# EAGLE design Tractive System Board Rev8 (EAGLE 9.6.2)

## Sheet 1 of 3
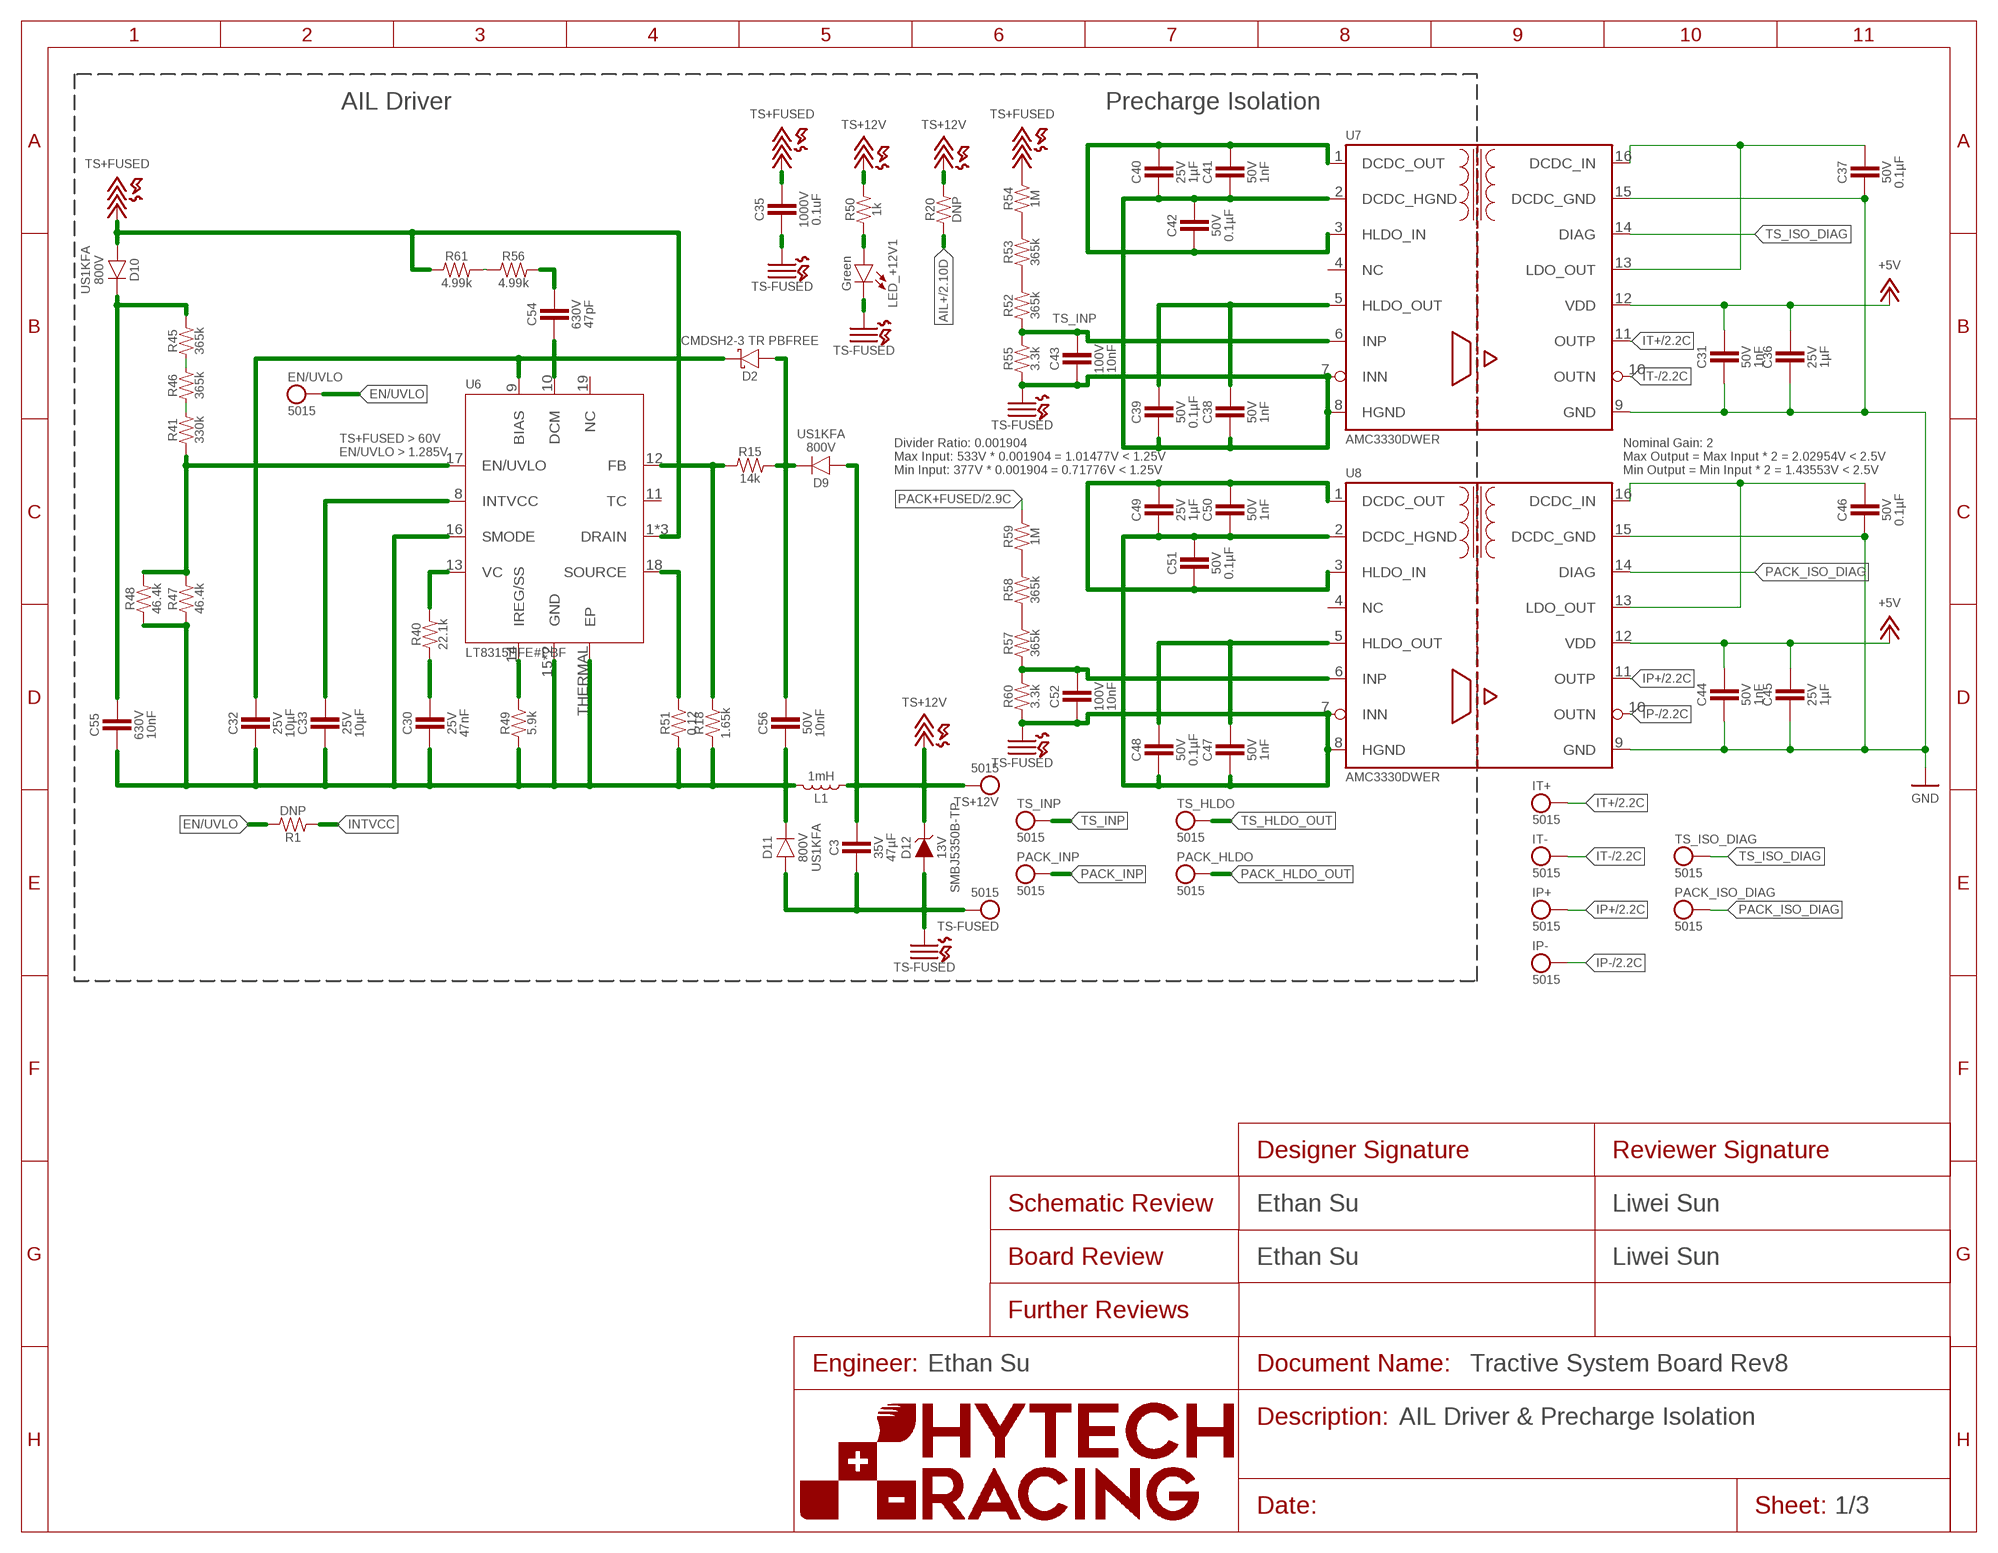
[diagram p0: schematic, sheet 1]
FRAME1 (FRAME): DESCRIPTION_1: AIL Driver & Precharge Isolation; DESIGNER_BOARD: Ethan Su; DESIGNER_SCHEMATIC: Ethan Su; ENGINEER: Ethan Su; REVIEWER_BOARD: Liwei Sun; REVIEWER_SCHEMATIC: Liwei Sun

### Parts
C3  CAPACITOR_2220_35V_47UF  [2220-CAP]
C30  CAPACITOR_0603_25V_47NF  [0603-CAP]
C31  CAPACITOR_1206_50V_1NF  [1206-CAP]
C32  CAPACITOR_0603_25V_10UF  [0603-CAP]
C33  CAPACITOR_0603_25V_10UF  [0603-CAP]
C35  CAPACITOR_1812_1000V_0.1UF  [1812-CAP]
C36  CAPACITOR_1206_25V_1UF  [1206-CAP]
C37  CAPACITOR_0603_50V_0.1UF  [0603-CAP]
C38  CAPACITOR_1206_50V_1NF  [1206-CAP]
C39  CAPACITOR_1206_50V_0.1UF  [1206-CAP]
C40  CAPACITOR_0603_25V_1UF  [0603-CAP]
C41  CAPACITOR_0603_50V_1NF  [0603-CAP]
C42  CAPACITOR_0603_50V_0.1UF  [0603-CAP]
C43  CAPACITOR_0603_100V_10NF  [0603-CAP]
C44  CAPACITOR_1206_50V_1NF  [1206-CAP]
C45  CAPACITOR_1206_25V_1UF  [1206-CAP]
C46  CAPACITOR_0603_50V_0.1UF  [0603-CAP]
C47  CAPACITOR_1206_50V_1NF  [1206-CAP]
C48  CAPACITOR_1206_50V_0.1UF  [1206-CAP]
C49  CAPACITOR_0603_25V_1UF  [0603-CAP]
C50  CAPACITOR_0603_50V_1NF  [0603-CAP]
C51  CAPACITOR_0603_50V_0.1UF  [0603-CAP]
C52  CAPACITOR_0603_100V_10NF  [0603-CAP]
C54  CAPACITOR_1206_630V_47PF  [1206-CAP]
C55  CAPACITOR_1206_630V_10NF  [1206-CAP]
C56  CAPACITOR_0603_50V_10NF  [0603-CAP]
D2  SCHOTTKY_SOD323_30VV  [SOD-323]
D9  RECTIFIER_800V_SOD-123FA  [SOD-123FA]
D10  RECTIFIER_800V_SOD-123FA  [SOD-123FA]
D11  RECTIFIER_800V_SOD-123FA  [SOD-123FA]
D12  ZENER_SMB(DO-214AA)_13V  [SMB(DO-214AA)]
EN/UVLO  TEST_POINT  [5015]
IP+  TEST_POINT  [5015]
IP-  TEST_POINT  [5015]
IT+  TEST_POINT  [5015]
IT-  TEST_POINT  [5015]
L1  INDUCTOR_SRR0745A_1MH  [SRR0745A-102M]
LED_+12V1  LED_0603_GREEN  [0603-LED]
PACK_HLDO  TEST_POINT  [5015]
PACK_INP  TEST_POINT  [5015]
PACK_ISO_DIAG  TEST_POINT  [5015]
R1  RESISTOR_0603_DNP  [0603-RES]
R15  RESISTOR_0603_14K  [0603-RES]
R18  RESISTOR_0603_1.65K  [0603-RES]
R20  RESISTOR_0603_DNP  [0603-RES]
R40  RESISTOR_0603_22.1K  [0603-RES]
R41  RESISTOR_0805_HV330K  [0805-RES]
R45  RESISTOR_0805_HV365K  [0805-RES]
R46  RESISTOR_0805_HV365K  [0805-RES]
R47  RESISTOR_1206_HV46.4K  [1206-RES]
R48  RESISTOR_1206_HV46.4K  [1206-RES]
R49  RESISTOR_0603_5.9K  [0603-RES]
R50  RESISTOR_0603_1K  [0603-RES]
R51  RESISTOR_0603_0.12  [0603-RES]
R52  RESISTOR_0805_HV365K  [0805-RES]
R53  RESISTOR_0805_HV365K  [0805-RES]
R54  RESISTOR_0805_HV1M  [0805-RES]
R55  RESISTOR_0603_HV3.3K  [0603-RES]
R56  RESISTOR_1206_HV4.99K  [1206-RES]
R57  RESISTOR_0805_HV365K  [0805-RES]
R58  RESISTOR_0805_HV365K  [0805-RES]
R59  RESISTOR_0805_HV1M  [0805-RES]
R60  RESISTOR_0603_HV3.3K  [0603-RES]
R61  RESISTOR_1206_HV4.99K  [1206-RES]
TS+12V  TEST_POINT  [5015]
TS-FUSED  TEST_POINT  [5015]
TS_HLDO  TEST_POINT  [5015]
TS_INP  TEST_POINT  [5015]
TS_ISO_DIAG  TEST_POINT  [5015]
U6  LT8315  [TSSOP-20(16)]
U7  AMC3330_AIRGAP  [SOIC-16W-AIRGAP]
U8  AMC3330_AIRGAP  [SOIC-16W-AIRGAP]

### Nets
+5V: C31.1 C36.1 C44.1 C45.1 U7.12(VDD) U8.12(VDD) ; also sheet 2
AIL+: R20.1 ; also sheet 2
EN/UVLO: EN/UVLO.1 R1.2 R41.1 R47.2 R48.2 U6.17(EN/UVLO)
FB: R15.1 R18.2 U6.12(FB)
GND: C31.2 C36.2 C37.2 C44.2 C45.2 C46.2 U7.9(GND) U7.15(DCDC_GND) U8.9(GND) U8.15(DCDC_GND) ; also sheet 2
INTVCC: C33.1 R1.1 U6.8(INTVCC)
IP+: IP+.1 U8.11(OUTP) ; also sheet 2
IP-: IP-.1 U8.10(OUTN) ; also sheet 2
IREG/SS: R49.2 U6.14(IREG/SS)
IT+: IT+.1 U7.11(OUTP) ; also sheet 2
IT-: IT-.1 U7.10(OUTN) ; also sheet 2
N$1: R41.2 R46.1
N$4: R45.1 R46.2
N$33: C37.1 U7.13(LDO_OUT) U7.16(DCDC_IN)
N$34: R56.1 R61.2
N$35: C54.1 R56.2
N$38: C54.2 U6.10(DCM)
N$43: C30.1 R40.1
N$44: LED_+12V1.2(A) R50.1
N$46: C55.1 D10.C R45.2
N$49: C32.1 D2.C U6.9(BIAS)
N$51: C40.1 C41.1 C42.2 U7.1(DCDC_OUT) U7.3(HLDO_IN)
N$52: C46.1 U8.13(LDO_OUT) U8.16(DCDC_IN)
N$55: C56.1 D2.A D9.C R15.2
N$59: R52.2 R53.1
N$60: R53.2 R54.1
N$64: C49.1 C50.1 C51.2 U8.1(DCDC_OUT) U8.3(HLDO_IN)
N$65: R57.2 R58.1
N$66: R58.2 R59.1
PACK+FUSED: R59.2 ; also sheet 2
PACK_HLDO_OUT: C47.1 C48.1 PACK_HLDO.1 U8.5(HLDO_OUT)
PACK_INP: C52.1 PACK_INP.1 R57.1 R60.2 U8.6(INP)
PACK_ISO_DIAG: PACK_ISO_DIAG.1 U8.14(DIAG)
PGND: C30.2 C32.2 C33.2 C55.2 C56.2 D11.C L1.2 R18.1 R47.1 R48.1 R49.1 R51.1 U6.15(GND) U6.16(SMODE) U6.20(GND) U6.THERMAL(EP)
SOURCE: R51.2 U6.18(SOURCE)
TS+12V: C3.1 D9.A D12.C L1.1 R20.2 R50.2 TS+12V.1
TS+FUSED: C35.1 D10.A R54.2 R61.1 U6.1(DRAIN) U6.2(DRAIN) U6.3(DRAIN) ; also sheet 2
TS-FUSED: C3.2 C35.2 C38.2 C39.2 C40.2 C41.2 C42.1 C43.2 C47.2 C48.2 C49.2 C50.2 C51.1 C52.2 D11.A D12.A LED_+12V1.1(C) R55.1 R60.1 TS-FUSED.1 U7.2(DCDC_HGND) U7.7(INN) U7.8(HGND) U8.2(DCDC_HGND) U8.7(INN) U8.8(HGND) ; also sheet 2
TS_HLDO_OUT: C38.1 C39.1 TS_HLDO.1 U7.5(HLDO_OUT)
TS_INP: C43.1 R52.1 R55.2 TS_INP.1 U7.6(INP)
TS_ISO_DIAG: TS_ISO_DIAG.1 U7.14(DIAG)
VC: R40.2 U6.13(VC)
Unconnected: U6.11(TC) U6.19(NC) U7.4(NC) U8.4(NC)

### Notes on the sheet
- AIL Driver | Precharge Isolation
- TS+FUSED > 60V
  EN/UVLO > 1.285V
- Divider Ratio: 0.001904
  Max Input: 533V * 0.001904 = 1.01477V < 1.25V
  Min Input: 377V * 0.001904 = 0.71776V < 1.25V
- Nominal Gain: 2
  Max Output = Max Input * 2 = 2.02954V < 2.5V
  Min Output = Min Input * 2 = 1.43553V < 2.5V

## Sheet 2 of 3
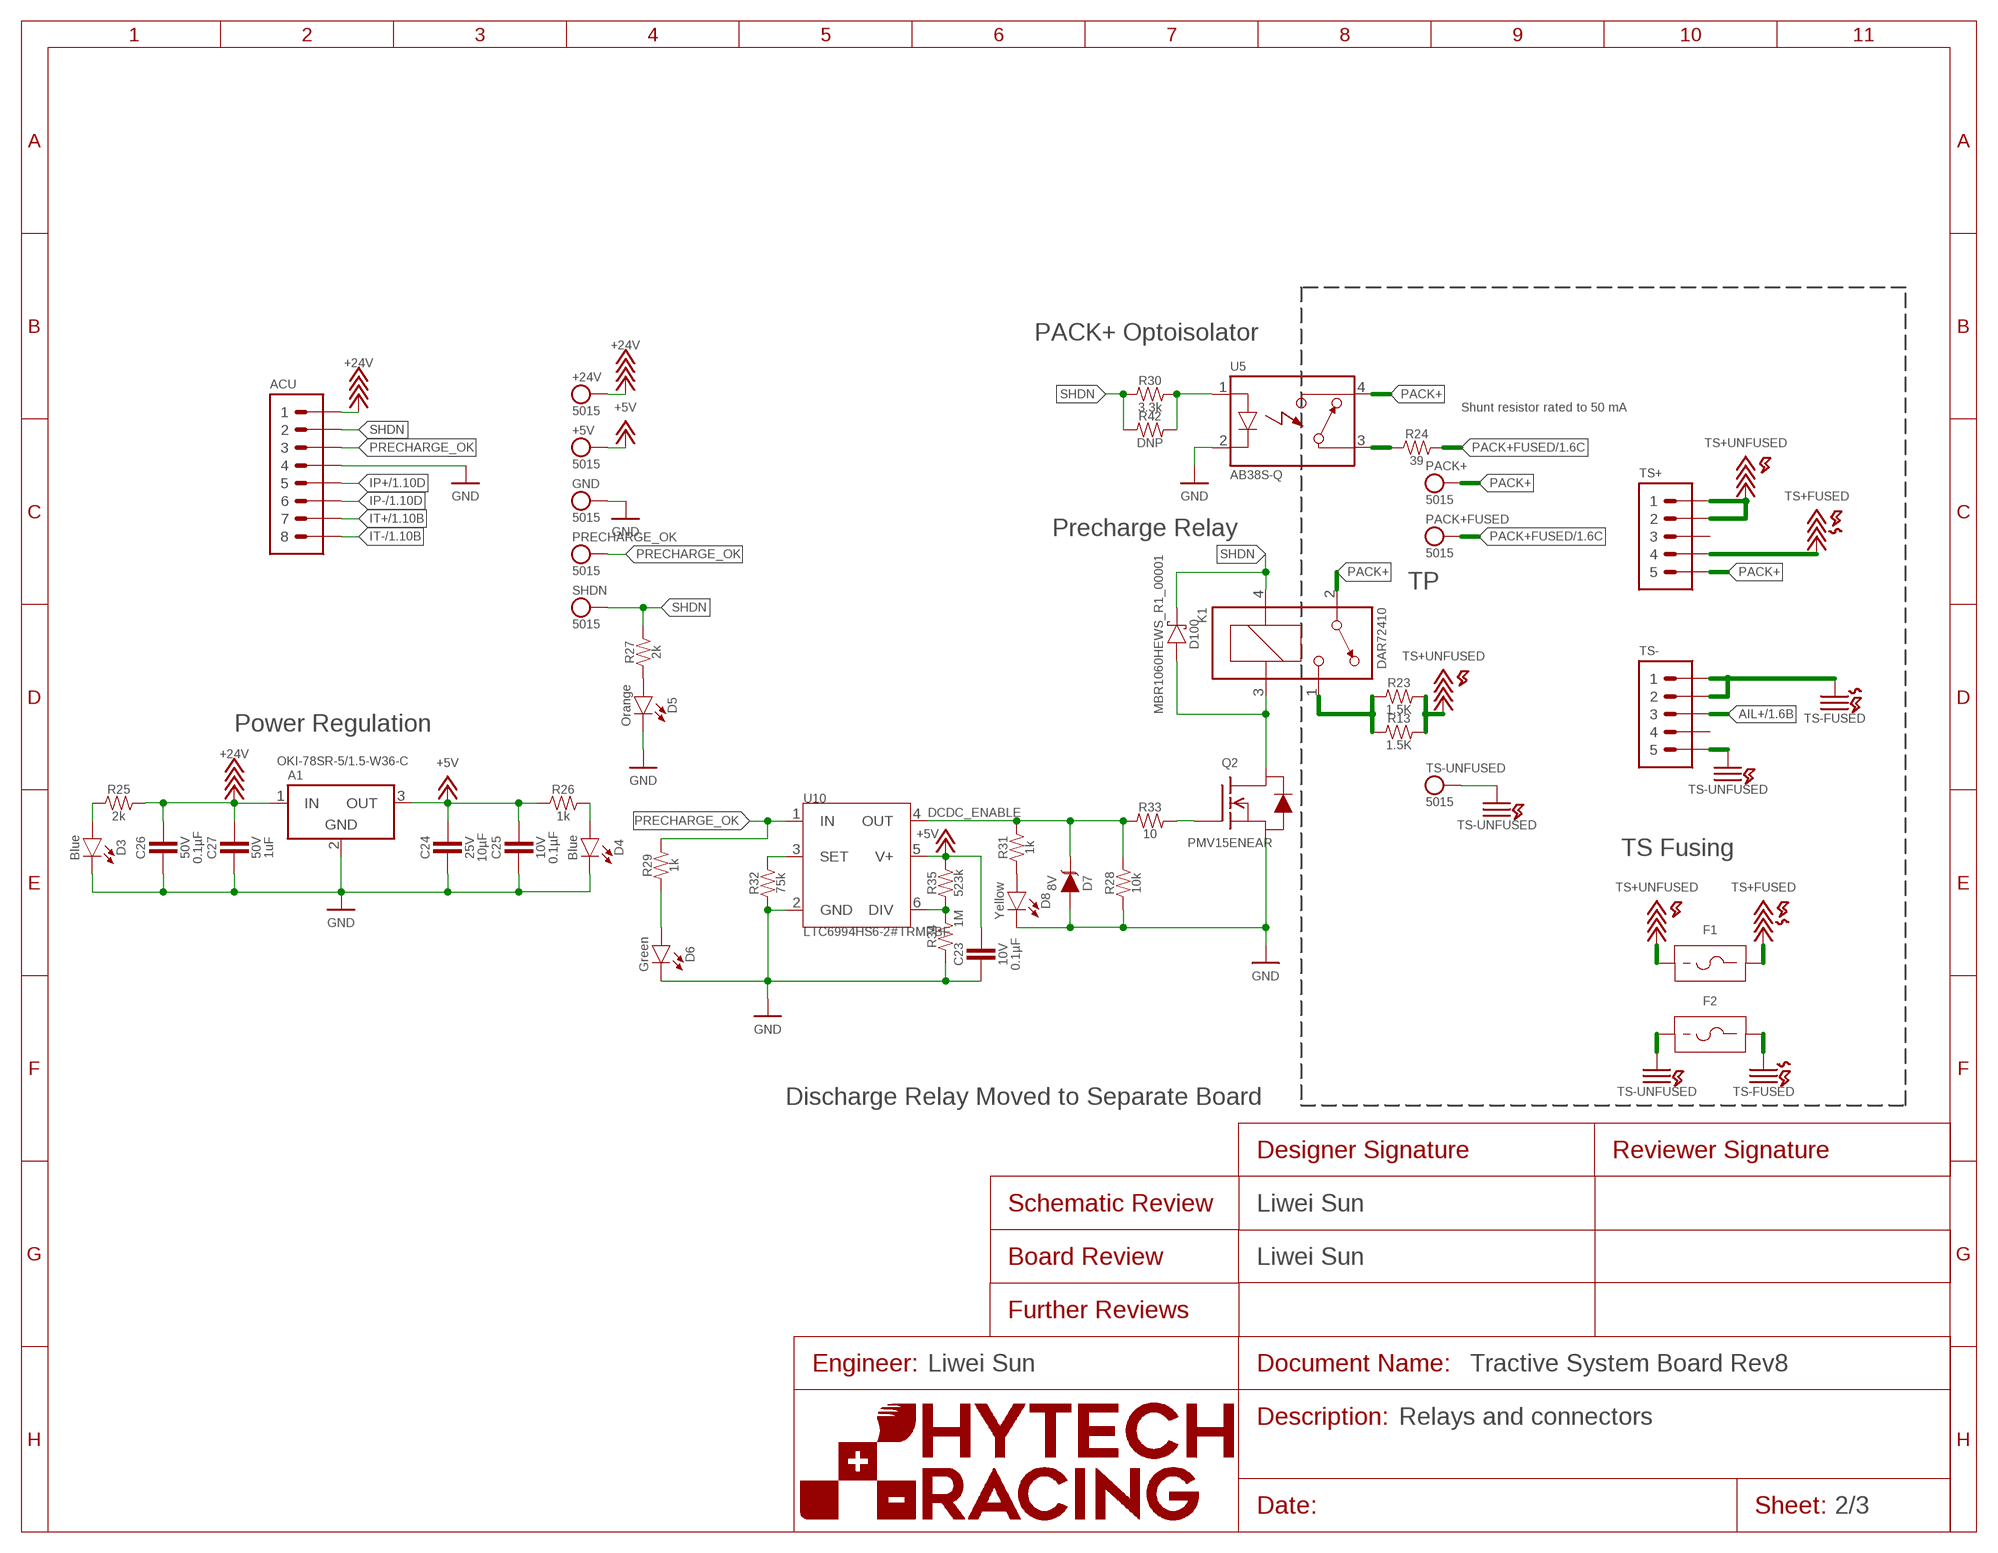
[diagram p1: schematic, sheet 2]
FRAME4 (FRAME): DESCRIPTION_1: Relays and connectors; DESIGNER_BOARD: Liwei Sun; DESIGNER_SCHEMATIC: Liwei Sun; ENGINEER: Liwei Sun

### Parts
+5V  TEST_POINT  [5015]
+24V  TEST_POINT  [5015]
A1  VOLTAGE_REGULATOR_MODULE_OKI-78SR_5V  [OKI-78SR]
ACU  CONNECTOR-8_μF_T_V_BLACK  [MOLEX_MICROFIT_PTH_VERTICAL_08_DUAL]
C23  CAPACITOR_0603_10V_0.1UF  [0603-CAP]
C24  CAPACITOR_0603_25V_10UF  [0603-CAP]
C25  CAPACITOR_0603_10V_0.1UF  [0603-CAP]
C26  CAPACITOR_0603_50V_0.1UF  [0603-CAP]
C27  CAPACITOR_0603_50V_1UF  [0603-CAP]
D3  LED_0603_BLUE  [0603-LED]
D4  LED_0603_BLUE  [0603-LED]
D5  LED_0603_ORANGE  [0603-LED]
D6  LED_0603_GREEN  [0603-LED]
D7  TVS__8V  [SOT-23]
D8  LED_0603_YELLOW  [0603-LED]
D100  SCHOTTKY_SOD323_60V  [SOD-323]
F1  FUSE_HOLDER_122  [122]
F2  FUSE_HOLDER_122  [122]
GND  TEST_POINT  [5015]
K1  RELAY_SPST_NO_D_24  [D]
PACK+  TEST_POINT  [5015]
PACK+FUSED  TEST_POINT  [5015]
PRECHARGE_OK  TEST_POINT  [5015]
Q2  TRANSISTOR_N_MOS__PMV15ENEA  [SOT-23]
R13  RESISTOR_B20-SHORTENED_1.5K  [B20-SHORTENED]
R23  RESISTOR_B20-SHORTENED_1.5K  [B20-SHORTENED]
R24  RESISTOR_0603_39  [0603-RES]
R25  RESISTOR_0603_2K  [0603-RES]
R26  RESISTOR_0603_1K  [0603-RES]
R27  RESISTOR_0603_2K  [0603-RES]
R28  RESISTOR_0603_10K  [0603-RES]
R29  RESISTOR_0603_1K  [0603-RES]
R30  RESISTOR_0603_3.3K  [0603-RES]
R31  RESISTOR_0603_1K  [0603-RES]
R32  RESISTOR_0603_75K  [0603-RES]
R33  RESISTOR_0603_10  [0603-RES]
R34  RESISTOR_0805_1M  [0805-RES]
R35  RESISTOR_0805_523K  [0805-RES]
R42  RESISTOR_0603_DNP  [0603-RES]
SHDN  TEST_POINT  [5015]
TS+  CONNECTOR-5_MICRO_V7S_  [MOLEX_MICROFIT_PTH_VERTICAL_07_SINGLE_SPACED]
TS-  CONNECTOR-5_MICRO_V6S_  [MOLEX_MICROFIT_PTH_VERTICAL_06_SINGLE_SPACED]
TS-UNFUSED  TEST_POINT  [5015]
U5  RELAY_SOLIDSTATE_NO_AB38S-Q-AIRGAP  [SOP-04-AIRGAP]
U10  LTC6994-2  [SOT-23-6]

### Nets
+5V: +5V.1 A1.3(OUT) C23.1 C24.1 C25.1 R26.1 R35.2 U10.5(V+) ; also sheet 1
+24V: +24V.1 A1.1(IN) ACU.1 C26.1 C27.1 R25.2
AIL+: TS-.3 ; also sheet 1
DCDC_ENABLE: D7.3(C) R28.2 R31.2 R33.1 U10.4(OUT)
GND: A1.2(GND) ACU.4 C23.2 C24.2 C25.2 C26.2 C27.2 D3.1(C) D4.1(C) D5.1(C) D6.1(C) D7.1(A) D8.1(C) GND.1 Q2.2(S) R28.1 R32.1 R34.1 U5.2(CONTROL-) U10.2(GND) ; also sheet 1
IP+: ACU.5 ; also sheet 1
IP-: ACU.6 ; also sheet 1
IT+: ACU.7 ; also sheet 1
IT-: ACU.8 ; also sheet 1
N$2: D5.2(A) R27.1
N$3: Q2.1(G) R33.2
N$10: R32.2 U10.3(SET)
N$11: R34.2 R35.1 U10.6(DIV)
N$22: D6.2(A) R29.1
N$24: D8.2(A) R31.1
N$25: D3.2(A) R25.1
N$30: D4.2(A) R26.2
N$40: D100.A K1.3(COIL-) Q2.3(D)
N$50: K1.1(CONTACT2) R13.1 R23.1
N$53: R30.2 R42.2 U5.1(CONTROL+)
N$57: R24.1 U5.3(CONTACT1)
PACK+: K1.2(CONTACT1) PACK+.1 TS+.5 U5.4(CONTACT2)
PACK+FUSED: PACK+FUSED.1 R24.2 ; also sheet 1
PRECHARGE_OK: ACU.3 PRECHARGE_OK.1 R29.2 U10.1(IN)
SHDN: ACU.2 D100.C K1.4(COIL+) R27.2 R30.1 R42.1 SHDN.1
TS+FUSED: F1.3 F1.4 TS+.4 ; also sheet 1
TS+UNFUSED: F1.1 F1.2 R13.2 R23.2 TS+.1 TS+.2
TS-FUSED: F2.3 F2.4 TS-.1 TS-.2 ; also sheet 1
TS-UNFUSED: F2.1 F2.2 TS-.5 TS-UNFUSED.1
Unconnected: TS+.3 TS-.4

### Notes on the sheet
- PACK+ Optoisolator
- Shunt resistor rated to 50 mA
- Precharge Relay
- TP
- Power Regulation
- TS Fusing
- Discharge Relay Moved to Separate Board

## Sheet 3 of 3
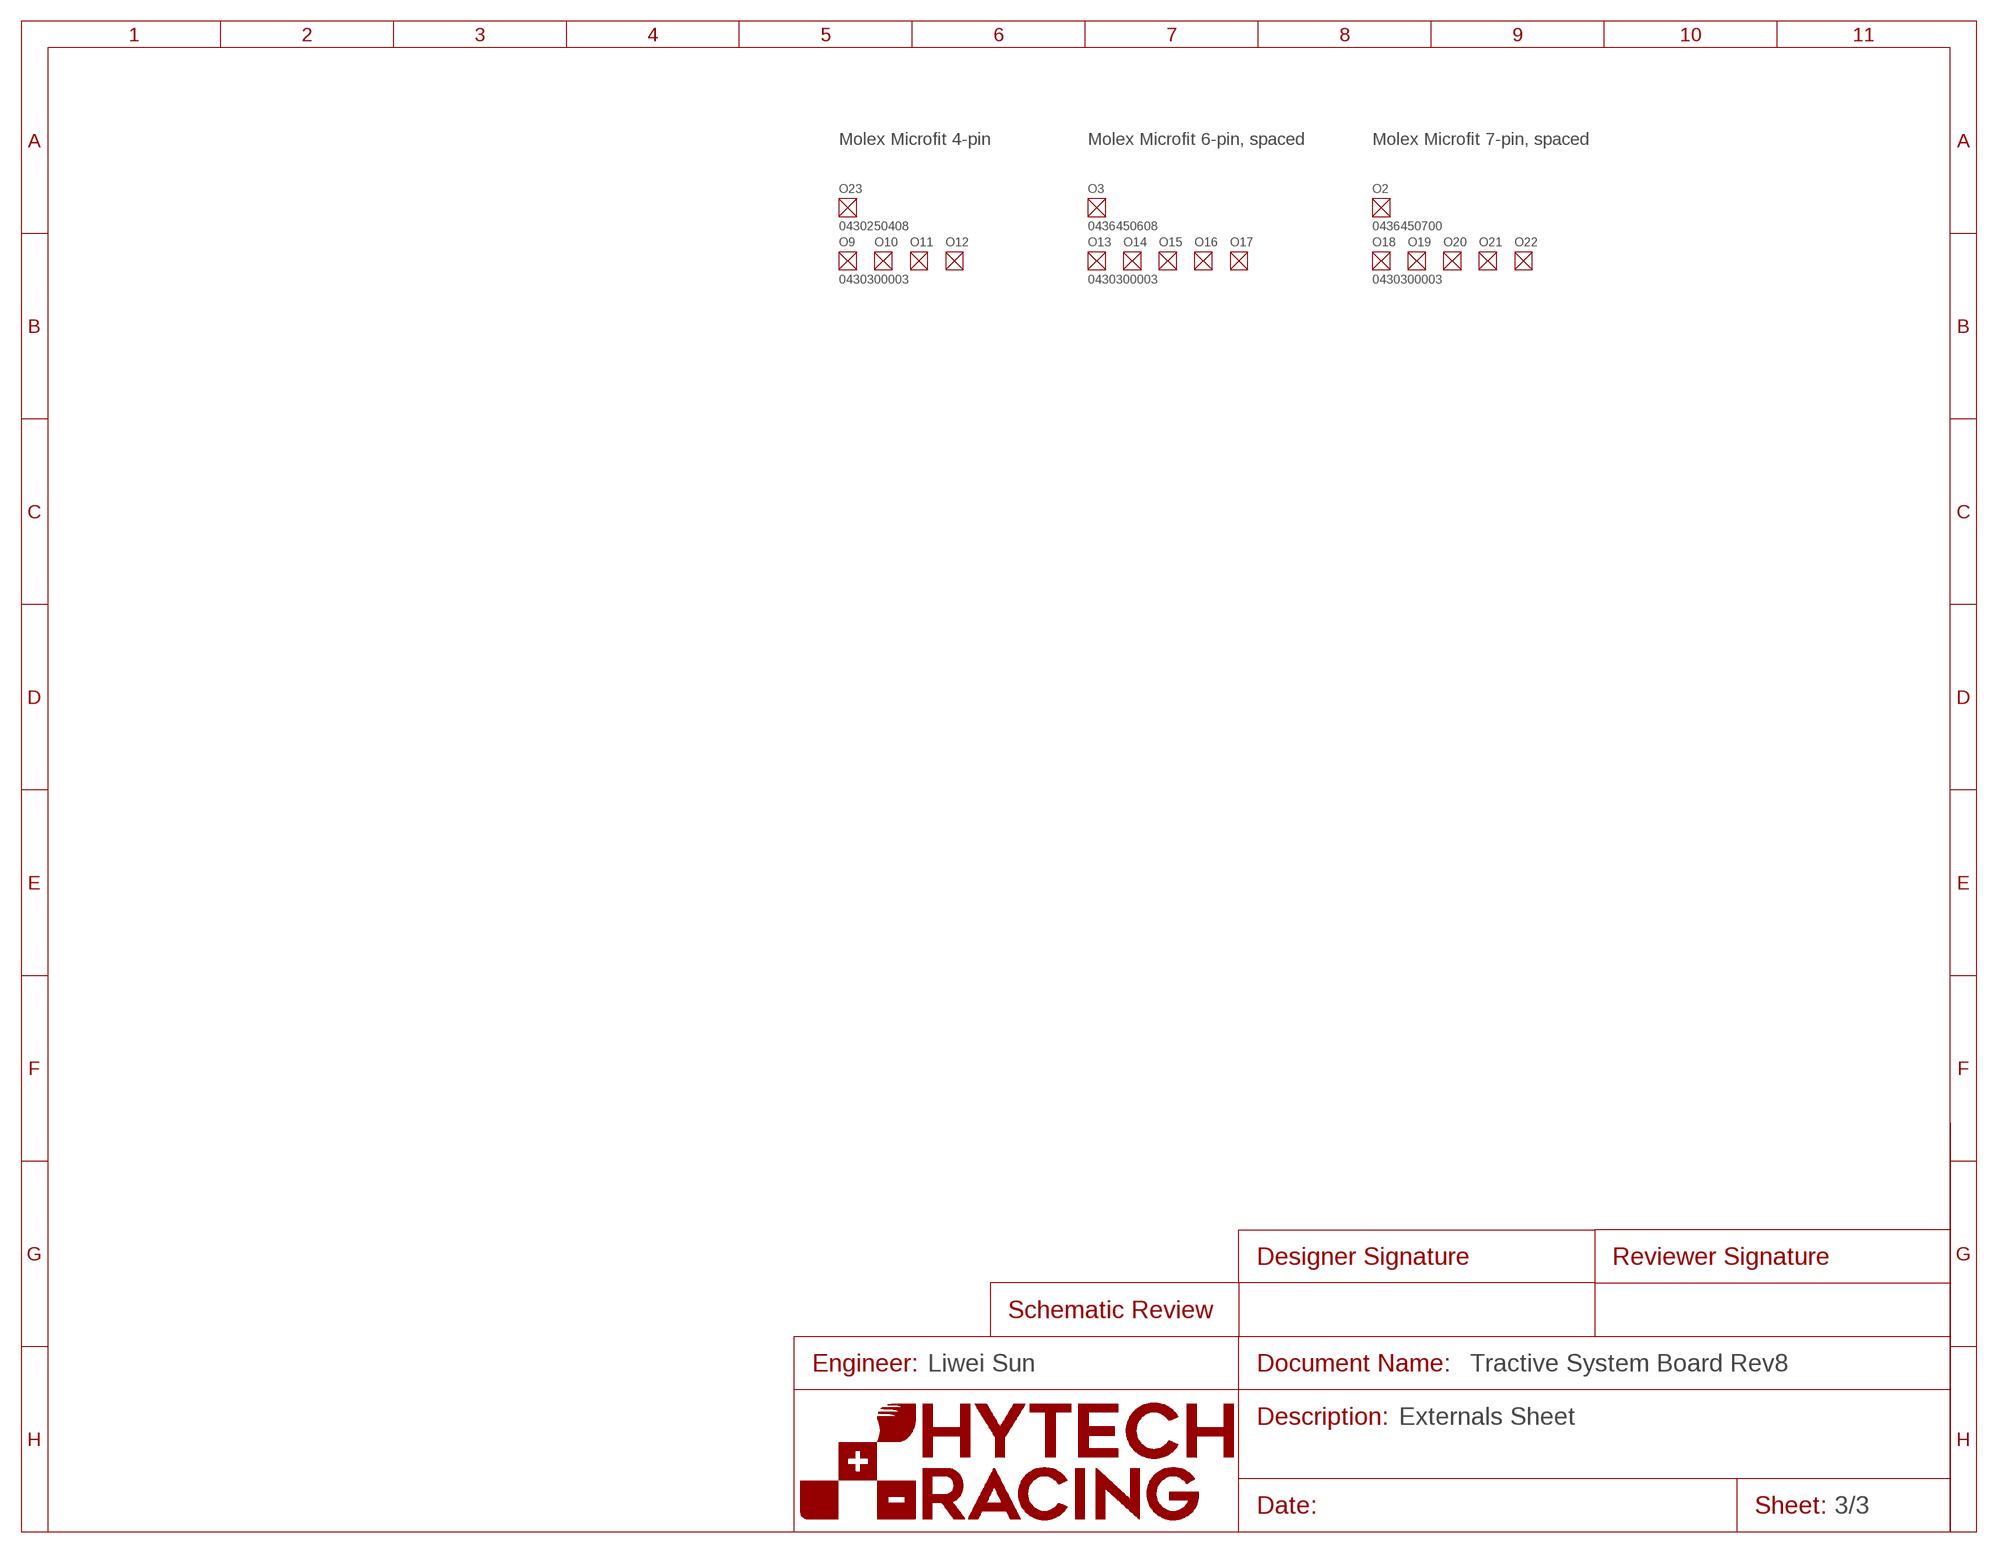
[diagram p2: schematic, sheet 3]
O2 (RECEPTACLE-7_MICROFIT): DKPN: WM2405-ND; MANUFACTURER: Molex; MOPN: 538-43645-0700; MPN: 0436450700
O3 (RECEPTACLE-6_SINGLE_MICROFIT): DKPN: WM13217-ND; MANUFACTURER: Molex; MOPN: 538-43645-0608; MPN: 0436450608
O9 (CRIMP_MICROFIT_20-24): DKPN: WM2776CT-ND; GAUGE: 20-24; MANUFACTURER: Molex; MOPN: 538-43030-0003; MPN: 0430300003
O10 (CRIMP_MICROFIT_20-24): DKPN: WM2776CT-ND; GAUGE: 20-24; MANUFACTURER: Molex; MOPN: 538-43030-0003; MPN: 0430300003
O11 (CRIMP_MICROFIT_20-24): DKPN: WM2776CT-ND; GAUGE: 20-24; MANUFACTURER: Molex; MOPN: 538-43030-0003; MPN: 0430300003
O12 (CRIMP_MICROFIT_20-24): DKPN: WM2776CT-ND; GAUGE: 20-24; MANUFACTURER: Molex; MOPN: 538-43030-0003; MPN: 0430300003
O13 (CRIMP_MICROFIT_20-24): DKPN: WM2776CT-ND; GAUGE: 20-24; MANUFACTURER: Molex; MOPN: 538-43030-0003; MPN: 0430300003
O14 (CRIMP_MICROFIT_20-24): DKPN: WM2776CT-ND; GAUGE: 20-24; MANUFACTURER: Molex; MOPN: 538-43030-0003; MPN: 0430300003
O15 (CRIMP_MICROFIT_20-24): DKPN: WM2776CT-ND; GAUGE: 20-24; MANUFACTURER: Molex; MOPN: 538-43030-0003; MPN: 0430300003
O16 (CRIMP_MICROFIT_20-24): DKPN: WM2776CT-ND; GAUGE: 20-24; MANUFACTURER: Molex; MOPN: 538-43030-0003; MPN: 0430300003
O17 (CRIMP_MICROFIT_20-24): DKPN: WM2776CT-ND; GAUGE: 20-24; MANUFACTURER: Molex; MOPN: 538-43030-0003; MPN: 0430300003
O18 (CRIMP_MICROFIT_20-24): DKPN: WM2776CT-ND; GAUGE: 20-24; MANUFACTURER: Molex; MOPN: 538-43030-0003; MPN: 0430300003
O19 (CRIMP_MICROFIT_20-24): DKPN: WM2776CT-ND; GAUGE: 20-24; MANUFACTURER: Molex; MOPN: 538-43030-0003; MPN: 0430300003
O20 (CRIMP_MICROFIT_20-24): DKPN: WM2776CT-ND; GAUGE: 20-24; MANUFACTURER: Molex; MOPN: 538-43030-0003; MPN: 0430300003
O21 (CRIMP_MICROFIT_20-24): DKPN: WM2776CT-ND; GAUGE: 20-24; MANUFACTURER: Molex; MOPN: 538-43030-0003; MPN: 0430300003
O22 (CRIMP_MICROFIT_20-24): DKPN: WM2776CT-ND; GAUGE: 20-24; MANUFACTURER: Molex; MOPN: 538-43030-0003; MPN: 0430300003
O23 (RECEPTACLE-4_MICROFIT): DKPN: WM11225-ND; MANUFACTURER: Molex; MOPN: 538-43025-0408; MPN: 0430250408
U$49 (FRAME_SCHEMATIC_ONLY): DESCRIPTION_1: Externals Sheet; ENGINEER: Liwei Sun

### Notes on the sheet
- Molex Microfit 4-pin | Molex Microfit 6-pin, spaced | Molex Microfit 7-pin, spaced

## Library data of the parts
+5V +24V EN/UVLO GND IP+ IP- IT+ IT- PACK+ PACK+FUSED PACK_HLDO PACK_INP PACK_ISO_DIAG PRECHARGE_OK SHDN TS+12V TS-FUSED TS-UNFUSED TS_HLDO TS_INP TS_ISO_DIAG = HyTechDevices:TEST_POINT: Test Point for Probing; DKPN: 36-5015CT-ND; MANUFACTURER: Keystone Electronics; MOPN: 534-5015; MPN: 5015
A1 = HyTechDevices:VOLTAGE_REGULATOR_MODULE_?_*: Voltage Regulator Modules OKI-78SR Datasheet <https://www.mouser.com/datasheet/2/281/oki-78sr-56393.pdf>; DKPN: 811-2196-5-ND; MANUFACTURER: Murata Power Solutions Inc.; MOPN: 580-OKI78SR5/1.5W36C; MPN: OKI-78SR-5/1.5-W36-C
ACU = HyTechDevices:CONNECTOR-8_?_*: 8 Pin Connector; DKPN: WM1798-ND; MANUFACTURER: Molex; MOPN: 538-43045-0814; MPN: 430450814
C3 = HyTechDevices:CAPACITOR_?_*: Capacitor, Non-Polarized VJ...1BC Series Datasheet <https://www.mouser.com/datasheet/2/427/vjw1bcbascomseries-1762447.pdf> Samsung Datasheet <https://www.mouser.com/datasheet/2/585/MLCC-1837944.pdf> Samsung Automotive MLCC Datasheet <https://www.mouser.com/datasheet/2/585/MLCC_Automotive-1837966.pdf> Walsin Datasheet <https://www.mouser.com/datasheet/2/210/WTC_MLCC_General_Purpose-1534899.pdf> GRM188R61A226ME15D <https://www.mouser.com/datasheet/2/281/1/GRM188R61A226ME15_02A-1985787.pdf> GRM188R61E106MA73D <https://www.mouser.com/datasheet/2/281/1/GRM188R61E106MA73_01A-1985806.pdf> 885012006013 <https://www.mouser.com/datasheet/2/445/885012006013-1726946.pdf> 2220Y6300105KXTWS2 <https://www.mouser.com/datasheet/2/218/SMD_High_and_Std_StackiCap_P62-1825512.pdf> Yageo Class 2, X5R <https://www.mouser.com/datasheet/2/447/UPY_GPHC_X5R_4V_to_50V_26-1827097.pdf> TDK C Series <https://www.mouser.com/ProductDetail/TDK/C3216X5R1V226M160AC?qs=%2Fha2pyFadujbcx9jh7lYl%2F4NeMoXFhdc8AqVWNq4wW6M2y7zl6GzBuhgtI0ngznN> AVX Automotive MLCC <https://www.mouser.com/datasheet/2/40/AutoMLCC-777028.pdf> KEMET X7R Series <https://www.mouser.com/datasheet/2/212/KEM_C1002_X7R_SMD-1102033.pdf> Kyocera AVX <https://www.mouser.com/datasheet/2/40/C0GNP0_Dielectric-951274.pdf> GRM21BR61H <https://www.mouser.com/datasheet/2/281/1/GRM21BR61H106KE43_01A-1986884.pdf> C1812W104KDRACTU <https://www.mouser.com/datasheet/2/212/KEM_C1034_X7R_HV_ARC_SMD-1101730.pdf> CGA series - MLCC Automotive grade <https://product.tdk.com/system/files/dam/doc/product/capacitor/ceramic/mlcc/catalog/mlcc_automotive_general_en.pdf>; CAPACITANCE: 47µF; DKPN: 445-CGA9N1X7R1V476M230KCCT-ND; MANUFACTURER: TDK Corporation; MOPN: 810-CGA9N1X7R1V476M2; MPN: CGA9N1X7R1V476M230KC; TOLERANCE: 20%; VOLTAGE: 35V
C23 C25 = HyTechDevices:CAPACITOR_?_*: Capacitor, Non-Polarized VJ...1BC Series Datasheet <https://www.mouser.com/datasheet/2/427/vjw1bcbascomseries-1762447.pdf> Samsung Datasheet <https://www.mouser.com/datasheet/2/585/MLCC-1837944.pdf> Samsung Automotive MLCC Datasheet <https://www.mouser.com/datasheet/2/585/MLCC_Automotive-1837966.pdf> Walsin Datasheet <https://www.mouser.com/datasheet/2/210/WTC_MLCC_General_Purpose-1534899.pdf> GRM188R61A226ME15D <https://www.mouser.com/datasheet/2/281/1/GRM188R61A226ME15_02A-1985787.pdf> GRM188R61E106MA73D <https://www.mouser.com/datasheet/2/281/1/GRM188R61E106MA73_01A-1985806.pdf> 885012006013 <https://www.mouser.com/datasheet/2/445/885012006013-1726946.pdf> 2220Y6300105KXTWS2 <https://www.mouser.com/datasheet/2/218/SMD_High_and_Std_StackiCap_P62-1825512.pdf> Yageo Class 2, X5R <https://www.mouser.com/datasheet/2/447/UPY_GPHC_X5R_4V_to_50V_26-1827097.pdf> TDK C Series <https://www.mouser.com/ProductDetail/TDK/C3216X5R1V226M160AC?qs=%2Fha2pyFadujbcx9jh7lYl%2F4NeMoXFhdc8AqVWNq4wW6M2y7zl6GzBuhgtI0ngznN> AVX Automotive MLCC <https://www.mouser.com/datasheet/2/40/AutoMLCC-777028.pdf> KEMET X7R Series <https://www.mouser.com/datasheet/2/212/KEM_C1002_X7R_SMD-1102033.pdf> Kyocera AVX <https://www.mouser.com/datasheet/2/40/C0GNP0_Dielectric-951274.pdf> GRM21BR61H <https://www.mouser.com/datasheet/2/281/1/GRM21BR61H106KE43_01A-1986884.pdf> C1812W104KDRACTU <https://www.mouser.com/datasheet/2/212/KEM_C1034_X7R_HV_ARC_SMD-1101730.pdf> CGA series - MLCC Automotive grade <https://product.tdk.com/system/files/dam/doc/product/capacitor/ceramic/mlcc/catalog/mlcc_automotive_general_en.pdf>; CAPACITANCE: 0.1µF; DKPN: 720-1688-1-ND; MANUFACTURER: Vishay Vitramon; MOPN: 77-VJ0603Y104JXQPBC; MPN: VJ0603Y104JXQPW1BC; TOLERANCE: 5%; VOLTAGE: 10V
C24 C32 C33 = HyTechDevices:CAPACITOR_?_*: Capacitor, Non-Polarized VJ...1BC Series Datasheet <https://www.mouser.com/datasheet/2/427/vjw1bcbascomseries-1762447.pdf> Samsung Datasheet <https://www.mouser.com/datasheet/2/585/MLCC-1837944.pdf> Samsung Automotive MLCC Datasheet <https://www.mouser.com/datasheet/2/585/MLCC_Automotive-1837966.pdf> Walsin Datasheet <https://www.mouser.com/datasheet/2/210/WTC_MLCC_General_Purpose-1534899.pdf> GRM188R61A226ME15D <https://www.mouser.com/datasheet/2/281/1/GRM188R61A226ME15_02A-1985787.pdf> GRM188R61E106MA73D <https://www.mouser.com/datasheet/2/281/1/GRM188R61E106MA73_01A-1985806.pdf> 885012006013 <https://www.mouser.com/datasheet/2/445/885012006013-1726946.pdf> 2220Y6300105KXTWS2 <https://www.mouser.com/datasheet/2/218/SMD_High_and_Std_StackiCap_P62-1825512.pdf> Yageo Class 2, X5R <https://www.mouser.com/datasheet/2/447/UPY_GPHC_X5R_4V_to_50V_26-1827097.pdf> TDK C Series <https://www.mouser.com/ProductDetail/TDK/C3216X5R1V226M160AC?qs=%2Fha2pyFadujbcx9jh7lYl%2F4NeMoXFhdc8AqVWNq4wW6M2y7zl6GzBuhgtI0ngznN> AVX Automotive MLCC <https://www.mouser.com/datasheet/2/40/AutoMLCC-777028.pdf> KEMET X7R Series <https://www.mouser.com/datasheet/2/212/KEM_C1002_X7R_SMD-1102033.pdf> Kyocera AVX <https://www.mouser.com/datasheet/2/40/C0GNP0_Dielectric-951274.pdf> GRM21BR61H <https://www.mouser.com/datasheet/2/281/1/GRM21BR61H106KE43_01A-1986884.pdf> C1812W104KDRACTU <https://www.mouser.com/datasheet/2/212/KEM_C1034_X7R_HV_ARC_SMD-1101730.pdf> CGA series - MLCC Automotive grade <https://product.tdk.com/system/files/dam/doc/product/capacitor/ceramic/mlcc/catalog/mlcc_automotive_general_en.pdf>; CAPACITANCE: 10µF; DKPN: 490-7202-1-ND; MANUFACTURER: Murata Electronics; MOPN: 81-GRM188R61E106MA3D; MPN: GRM188R61E106MA73D; TOLERANCE: 20%; VOLTAGE: 25V
C26 C37 C42 C46 C51 = HyTechDevices:CAPACITOR_?_*: Capacitor, Non-Polarized VJ...1BC Series Datasheet <https://www.mouser.com/datasheet/2/427/vjw1bcbascomseries-1762447.pdf> Samsung Datasheet <https://www.mouser.com/datasheet/2/585/MLCC-1837944.pdf> Samsung Automotive MLCC Datasheet <https://www.mouser.com/datasheet/2/585/MLCC_Automotive-1837966.pdf> Walsin Datasheet <https://www.mouser.com/datasheet/2/210/WTC_MLCC_General_Purpose-1534899.pdf> GRM188R61A226ME15D <https://www.mouser.com/datasheet/2/281/1/GRM188R61A226ME15_02A-1985787.pdf> GRM188R61E106MA73D <https://www.mouser.com/datasheet/2/281/1/GRM188R61E106MA73_01A-1985806.pdf> 885012006013 <https://www.mouser.com/datasheet/2/445/885012006013-1726946.pdf> 2220Y6300105KXTWS2 <https://www.mouser.com/datasheet/2/218/SMD_High_and_Std_StackiCap_P62-1825512.pdf> Yageo Class 2, X5R <https://www.mouser.com/datasheet/2/447/UPY_GPHC_X5R_4V_to_50V_26-1827097.pdf> TDK C Series <https://www.mouser.com/ProductDetail/TDK/C3216X5R1V226M160AC?qs=%2Fha2pyFadujbcx9jh7lYl%2F4NeMoXFhdc8AqVWNq4wW6M2y7zl6GzBuhgtI0ngznN> AVX Automotive MLCC <https://www.mouser.com/datasheet/2/40/AutoMLCC-777028.pdf> KEMET X7R Series <https://www.mouser.com/datasheet/2/212/KEM_C1002_X7R_SMD-1102033.pdf> Kyocera AVX <https://www.mouser.com/datasheet/2/40/C0GNP0_Dielectric-951274.pdf> GRM21BR61H <https://www.mouser.com/datasheet/2/281/1/GRM21BR61H106KE43_01A-1986884.pdf> C1812W104KDRACTU <https://www.mouser.com/datasheet/2/212/KEM_C1034_X7R_HV_ARC_SMD-1101730.pdf> CGA series - MLCC Automotive grade <https://product.tdk.com/system/files/dam/doc/product/capacitor/ceramic/mlcc/catalog/mlcc_automotive_general_en.pdf>; CAPACITANCE: 0.1µF; DKPN: 311-1344-1-ND; MANUFACTURER: Yageo; MOPN: 603-CC603KRX7R9BB104; MPN: CC0603KRX7R9BB104; TOLERANCE: 10%; VOLTAGE: 50V
C27 = HyTechDevices:CAPACITOR_?_*: Capacitor, Non-Polarized VJ...1BC Series Datasheet <https://www.mouser.com/datasheet/2/427/vjw1bcbascomseries-1762447.pdf> Samsung Datasheet <https://www.mouser.com/datasheet/2/585/MLCC-1837944.pdf> Samsung Automotive MLCC Datasheet <https://www.mouser.com/datasheet/2/585/MLCC_Automotive-1837966.pdf> Walsin Datasheet <https://www.mouser.com/datasheet/2/210/WTC_MLCC_General_Purpose-1534899.pdf> GRM188R61A226ME15D <https://www.mouser.com/datasheet/2/281/1/GRM188R61A226ME15_02A-1985787.pdf> GRM188R61E106MA73D <https://www.mouser.com/datasheet/2/281/1/GRM188R61E106MA73_01A-1985806.pdf> 885012006013 <https://www.mouser.com/datasheet/2/445/885012006013-1726946.pdf> 2220Y6300105KXTWS2 <https://www.mouser.com/datasheet/2/218/SMD_High_and_Std_StackiCap_P62-1825512.pdf> Yageo Class 2, X5R <https://www.mouser.com/datasheet/2/447/UPY_GPHC_X5R_4V_to_50V_26-1827097.pdf> TDK C Series <https://www.mouser.com/ProductDetail/TDK/C3216X5R1V226M160AC?qs=%2Fha2pyFadujbcx9jh7lYl%2F4NeMoXFhdc8AqVWNq4wW6M2y7zl6GzBuhgtI0ngznN> AVX Automotive MLCC <https://www.mouser.com/datasheet/2/40/AutoMLCC-777028.pdf> KEMET X7R Series <https://www.mouser.com/datasheet/2/212/KEM_C1002_X7R_SMD-1102033.pdf> Kyocera AVX <https://www.mouser.com/datasheet/2/40/C0GNP0_Dielectric-951274.pdf> GRM21BR61H <https://www.mouser.com/datasheet/2/281/1/GRM21BR61H106KE43_01A-1986884.pdf> C1812W104KDRACTU <https://www.mouser.com/datasheet/2/212/KEM_C1034_X7R_HV_ARC_SMD-1101730.pdf> CGA series - MLCC Automotive grade <https://product.tdk.com/system/files/dam/doc/product/capacitor/ceramic/mlcc/catalog/mlcc_automotive_general_en.pdf>; CAPACITANCE: 1uF; DKPN: 587-2400-2-ND; MANUFACTURER: Taiyo Yuden; MOPN: 963-UMK107BJ105KA-T; MPN: UMK107BJ105KA-T; TOLERANCE: 10%; VOLTAGE: 50V
C30 = HyTechDevices:CAPACITOR_?_*: Capacitor, Non-Polarized VJ...1BC Series Datasheet <https://www.mouser.com/datasheet/2/427/vjw1bcbascomseries-1762447.pdf> Samsung Datasheet <https://www.mouser.com/datasheet/2/585/MLCC-1837944.pdf> Samsung Automotive MLCC Datasheet <https://www.mouser.com/datasheet/2/585/MLCC_Automotive-1837966.pdf> Walsin Datasheet <https://www.mouser.com/datasheet/2/210/WTC_MLCC_General_Purpose-1534899.pdf> GRM188R61A226ME15D <https://www.mouser.com/datasheet/2/281/1/GRM188R61A226ME15_02A-1985787.pdf> GRM188R61E106MA73D <https://www.mouser.com/datasheet/2/281/1/GRM188R61E106MA73_01A-1985806.pdf> 885012006013 <https://www.mouser.com/datasheet/2/445/885012006013-1726946.pdf> 2220Y6300105KXTWS2 <https://www.mouser.com/datasheet/2/218/SMD_High_and_Std_StackiCap_P62-1825512.pdf> Yageo Class 2, X5R <https://www.mouser.com/datasheet/2/447/UPY_GPHC_X5R_4V_to_50V_26-1827097.pdf> TDK C Series <https://www.mouser.com/ProductDetail/TDK/C3216X5R1V226M160AC?qs=%2Fha2pyFadujbcx9jh7lYl%2F4NeMoXFhdc8AqVWNq4wW6M2y7zl6GzBuhgtI0ngznN> AVX Automotive MLCC <https://www.mouser.com/datasheet/2/40/AutoMLCC-777028.pdf> KEMET X7R Series <https://www.mouser.com/datasheet/2/212/KEM_C1002_X7R_SMD-1102033.pdf> Kyocera AVX <https://www.mouser.com/datasheet/2/40/C0GNP0_Dielectric-951274.pdf> GRM21BR61H <https://www.mouser.com/datasheet/2/281/1/GRM21BR61H106KE43_01A-1986884.pdf> C1812W104KDRACTU <https://www.mouser.com/datasheet/2/212/KEM_C1034_X7R_HV_ARC_SMD-1101730.pdf> CGA series - MLCC Automotive grade <https://product.tdk.com/system/files/dam/doc/product/capacitor/ceramic/mlcc/catalog/mlcc_automotive_general_en.pdf>; CAPACITANCE: 47nF; DKPN: 478-6340-1-ND; MANUFACTURER: Kyocera AVX; MOPN: 581-06033C473K42ZA; MPN: 06033C473K4Z2A; TOLERANCE: 10%; VOLTAGE: 25V
C31 C38 C44 C47 = HyTechDevices:CAPACITOR_?_*: Capacitor, Non-Polarized VJ...1BC Series Datasheet <https://www.mouser.com/datasheet/2/427/vjw1bcbascomseries-1762447.pdf> Samsung Datasheet <https://www.mouser.com/datasheet/2/585/MLCC-1837944.pdf> Samsung Automotive MLCC Datasheet <https://www.mouser.com/datasheet/2/585/MLCC_Automotive-1837966.pdf> Walsin Datasheet <https://www.mouser.com/datasheet/2/210/WTC_MLCC_General_Purpose-1534899.pdf> GRM188R61A226ME15D <https://www.mouser.com/datasheet/2/281/1/GRM188R61A226ME15_02A-1985787.pdf> GRM188R61E106MA73D <https://www.mouser.com/datasheet/2/281/1/GRM188R61E106MA73_01A-1985806.pdf> 885012006013 <https://www.mouser.com/datasheet/2/445/885012006013-1726946.pdf> 2220Y6300105KXTWS2 <https://www.mouser.com/datasheet/2/218/SMD_High_and_Std_StackiCap_P62-1825512.pdf> Yageo Class 2, X5R <https://www.mouser.com/datasheet/2/447/UPY_GPHC_X5R_4V_to_50V_26-1827097.pdf> TDK C Series <https://www.mouser.com/ProductDetail/TDK/C3216X5R1V226M160AC?qs=%2Fha2pyFadujbcx9jh7lYl%2F4NeMoXFhdc8AqVWNq4wW6M2y7zl6GzBuhgtI0ngznN> AVX Automotive MLCC <https://www.mouser.com/datasheet/2/40/AutoMLCC-777028.pdf> KEMET X7R Series <https://www.mouser.com/datasheet/2/212/KEM_C1002_X7R_SMD-1102033.pdf> Kyocera AVX <https://www.mouser.com/datasheet/2/40/C0GNP0_Dielectric-951274.pdf> GRM21BR61H <https://www.mouser.com/datasheet/2/281/1/GRM21BR61H106KE43_01A-1986884.pdf> C1812W104KDRACTU <https://www.mouser.com/datasheet/2/212/KEM_C1034_X7R_HV_ARC_SMD-1101730.pdf> CGA series - MLCC Automotive grade <https://product.tdk.com/system/files/dam/doc/product/capacitor/ceramic/mlcc/catalog/mlcc_automotive_general_en.pdf>; CAPACITANCE: 1nF; DKPN: 478-KGM31BR71H102KTCT-ND; MANUFACTURER: KYOCERA AVX; MOPN: 581-12065C102K; MPN: KGM31BR71H102KT; TOLERANCE: 10%; VOLTAGE: 50V
C35 = HyTechDevices:CAPACITOR_?_*: Capacitor, Non-Polarized VJ...1BC Series Datasheet <https://www.mouser.com/datasheet/2/427/vjw1bcbascomseries-1762447.pdf> Samsung Datasheet <https://www.mouser.com/datasheet/2/585/MLCC-1837944.pdf> Samsung Automotive MLCC Datasheet <https://www.mouser.com/datasheet/2/585/MLCC_Automotive-1837966.pdf> Walsin Datasheet <https://www.mouser.com/datasheet/2/210/WTC_MLCC_General_Purpose-1534899.pdf> GRM188R61A226ME15D <https://www.mouser.com/datasheet/2/281/1/GRM188R61A226ME15_02A-1985787.pdf> GRM188R61E106MA73D <https://www.mouser.com/datasheet/2/281/1/GRM188R61E106MA73_01A-1985806.pdf> 885012006013 <https://www.mouser.com/datasheet/2/445/885012006013-1726946.pdf> 2220Y6300105KXTWS2 <https://www.mouser.com/datasheet/2/218/SMD_High_and_Std_StackiCap_P62-1825512.pdf> Yageo Class 2, X5R <https://www.mouser.com/datasheet/2/447/UPY_GPHC_X5R_4V_to_50V_26-1827097.pdf> TDK C Series <https://www.mouser.com/ProductDetail/TDK/C3216X5R1V226M160AC?qs=%2Fha2pyFadujbcx9jh7lYl%2F4NeMoXFhdc8AqVWNq4wW6M2y7zl6GzBuhgtI0ngznN> AVX Automotive MLCC <https://www.mouser.com/datasheet/2/40/AutoMLCC-777028.pdf> KEMET X7R Series <https://www.mouser.com/datasheet/2/212/KEM_C1002_X7R_SMD-1102033.pdf> Kyocera AVX <https://www.mouser.com/datasheet/2/40/C0GNP0_Dielectric-951274.pdf> GRM21BR61H <https://www.mouser.com/datasheet/2/281/1/GRM21BR61H106KE43_01A-1986884.pdf> C1812W104KDRACTU <https://www.mouser.com/datasheet/2/212/KEM_C1034_X7R_HV_ARC_SMD-1101730.pdf> CGA series - MLCC Automotive grade <https://product.tdk.com/system/files/dam/doc/product/capacitor/ceramic/mlcc/catalog/mlcc_automotive_general_en.pdf>; CAPACITANCE: 0.1uF; DKPN: 399-C1812W104KDRAC7800CT-ND; MANUFACTURER: KEMET; MOPN: 80-C1812W104KDR; MPN: C1812W104KDRAC7800; TOLERANCE: 10%; VOLTAGE: 1000V
C36 C45 = HyTechDevices:CAPACITOR_?_*: Capacitor, Non-Polarized VJ...1BC Series Datasheet <https://www.mouser.com/datasheet/2/427/vjw1bcbascomseries-1762447.pdf> Samsung Datasheet <https://www.mouser.com/datasheet/2/585/MLCC-1837944.pdf> Samsung Automotive MLCC Datasheet <https://www.mouser.com/datasheet/2/585/MLCC_Automotive-1837966.pdf> Walsin Datasheet <https://www.mouser.com/datasheet/2/210/WTC_MLCC_General_Purpose-1534899.pdf> GRM188R61A226ME15D <https://www.mouser.com/datasheet/2/281/1/GRM188R61A226ME15_02A-1985787.pdf> GRM188R61E106MA73D <https://www.mouser.com/datasheet/2/281/1/GRM188R61E106MA73_01A-1985806.pdf> 885012006013 <https://www.mouser.com/datasheet/2/445/885012006013-1726946.pdf> 2220Y6300105KXTWS2 <https://www.mouser.com/datasheet/2/218/SMD_High_and_Std_StackiCap_P62-1825512.pdf> Yageo Class 2, X5R <https://www.mouser.com/datasheet/2/447/UPY_GPHC_X5R_4V_to_50V_26-1827097.pdf> TDK C Series <https://www.mouser.com/ProductDetail/TDK/C3216X5R1V226M160AC?qs=%2Fha2pyFadujbcx9jh7lYl%2F4NeMoXFhdc8AqVWNq4wW6M2y7zl6GzBuhgtI0ngznN> AVX Automotive MLCC <https://www.mouser.com/datasheet/2/40/AutoMLCC-777028.pdf> KEMET X7R Series <https://www.mouser.com/datasheet/2/212/KEM_C1002_X7R_SMD-1102033.pdf> Kyocera AVX <https://www.mouser.com/datasheet/2/40/C0GNP0_Dielectric-951274.pdf> GRM21BR61H <https://www.mouser.com/datasheet/2/281/1/GRM21BR61H106KE43_01A-1986884.pdf> C1812W104KDRACTU <https://www.mouser.com/datasheet/2/212/KEM_C1034_X7R_HV_ARC_SMD-1101730.pdf> CGA series - MLCC Automotive grade <https://product.tdk.com/system/files/dam/doc/product/capacitor/ceramic/mlcc/catalog/mlcc_automotive_general_en.pdf>; CAPACITANCE: 1µF; DKPN: 478-KGM31HR71E105KUCT-ND; MANUFACTURER: KYOCERA AVX; MOPN: 581-12063C105K; MPN: KGM31HR71E105KU; TOLERANCE: 10%; VOLTAGE: 25V
C39 C48 = HyTechDevices:CAPACITOR_?_*: Capacitor, Non-Polarized VJ...1BC Series Datasheet <https://www.mouser.com/datasheet/2/427/vjw1bcbascomseries-1762447.pdf> Samsung Datasheet <https://www.mouser.com/datasheet/2/585/MLCC-1837944.pdf> Samsung Automotive MLCC Datasheet <https://www.mouser.com/datasheet/2/585/MLCC_Automotive-1837966.pdf> Walsin Datasheet <https://www.mouser.com/datasheet/2/210/WTC_MLCC_General_Purpose-1534899.pdf> GRM188R61A226ME15D <https://www.mouser.com/datasheet/2/281/1/GRM188R61A226ME15_02A-1985787.pdf> GRM188R61E106MA73D <https://www.mouser.com/datasheet/2/281/1/GRM188R61E106MA73_01A-1985806.pdf> 885012006013 <https://www.mouser.com/datasheet/2/445/885012006013-1726946.pdf> 2220Y6300105KXTWS2 <https://www.mouser.com/datasheet/2/218/SMD_High_and_Std_StackiCap_P62-1825512.pdf> Yageo Class 2, X5R <https://www.mouser.com/datasheet/2/447/UPY_GPHC_X5R_4V_to_50V_26-1827097.pdf> TDK C Series <https://www.mouser.com/ProductDetail/TDK/C3216X5R1V226M160AC?qs=%2Fha2pyFadujbcx9jh7lYl%2F4NeMoXFhdc8AqVWNq4wW6M2y7zl6GzBuhgtI0ngznN> AVX Automotive MLCC <https://www.mouser.com/datasheet/2/40/AutoMLCC-777028.pdf> KEMET X7R Series <https://www.mouser.com/datasheet/2/212/KEM_C1002_X7R_SMD-1102033.pdf> Kyocera AVX <https://www.mouser.com/datasheet/2/40/C0GNP0_Dielectric-951274.pdf> GRM21BR61H <https://www.mouser.com/datasheet/2/281/1/GRM21BR61H106KE43_01A-1986884.pdf> C1812W104KDRACTU <https://www.mouser.com/datasheet/2/212/KEM_C1034_X7R_HV_ARC_SMD-1101730.pdf> CGA series - MLCC Automotive grade <https://product.tdk.com/system/files/dam/doc/product/capacitor/ceramic/mlcc/catalog/mlcc_automotive_general_en.pdf>; CAPACITANCE: 0.1µF; DKPN: 445-14655-1-ND; MANUFACTURER: TDK Corporation; MOPN: 810-C3216NP01H104J1A; MPN: C3216NP01H104J160AA; TOLERANCE: 5%; VOLTAGE: 50V
C40 C49 = HyTechDevices:CAPACITOR_?_*: Capacitor, Non-Polarized VJ...1BC Series Datasheet <https://www.mouser.com/datasheet/2/427/vjw1bcbascomseries-1762447.pdf> Samsung Datasheet <https://www.mouser.com/datasheet/2/585/MLCC-1837944.pdf> Samsung Automotive MLCC Datasheet <https://www.mouser.com/datasheet/2/585/MLCC_Automotive-1837966.pdf> Walsin Datasheet <https://www.mouser.com/datasheet/2/210/WTC_MLCC_General_Purpose-1534899.pdf> GRM188R61A226ME15D <https://www.mouser.com/datasheet/2/281/1/GRM188R61A226ME15_02A-1985787.pdf> GRM188R61E106MA73D <https://www.mouser.com/datasheet/2/281/1/GRM188R61E106MA73_01A-1985806.pdf> 885012006013 <https://www.mouser.com/datasheet/2/445/885012006013-1726946.pdf> 2220Y6300105KXTWS2 <https://www.mouser.com/datasheet/2/218/SMD_High_and_Std_StackiCap_P62-1825512.pdf> Yageo Class 2, X5R <https://www.mouser.com/datasheet/2/447/UPY_GPHC_X5R_4V_to_50V_26-1827097.pdf> TDK C Series <https://www.mouser.com/ProductDetail/TDK/C3216X5R1V226M160AC?qs=%2Fha2pyFadujbcx9jh7lYl%2F4NeMoXFhdc8AqVWNq4wW6M2y7zl6GzBuhgtI0ngznN> AVX Automotive MLCC <https://www.mouser.com/datasheet/2/40/AutoMLCC-777028.pdf> KEMET X7R Series <https://www.mouser.com/datasheet/2/212/KEM_C1002_X7R_SMD-1102033.pdf> Kyocera AVX <https://www.mouser.com/datasheet/2/40/C0GNP0_Dielectric-951274.pdf> GRM21BR61H <https://www.mouser.com/datasheet/2/281/1/GRM21BR61H106KE43_01A-1986884.pdf> C1812W104KDRACTU <https://www.mouser.com/datasheet/2/212/KEM_C1034_X7R_HV_ARC_SMD-1101730.pdf> CGA series - MLCC Automotive grade <https://product.tdk.com/system/files/dam/doc/product/capacitor/ceramic/mlcc/catalog/mlcc_automotive_general_en.pdf>; CAPACITANCE: 1µF; DKPN: 1276-1184-1-ND; MANUFACTURER: Samsung Electro-Mechanics; MOPN: 187-CL10B105KA8NNNC; MPN: CL10B105KA8NNNC; TOLERANCE: 10%; VOLTAGE: 25V
C41 C50 = HyTechDevices:CAPACITOR_?_*: Capacitor, Non-Polarized VJ...1BC Series Datasheet <https://www.mouser.com/datasheet/2/427/vjw1bcbascomseries-1762447.pdf> Samsung Datasheet <https://www.mouser.com/datasheet/2/585/MLCC-1837944.pdf> Samsung Automotive MLCC Datasheet <https://www.mouser.com/datasheet/2/585/MLCC_Automotive-1837966.pdf> Walsin Datasheet <https://www.mouser.com/datasheet/2/210/WTC_MLCC_General_Purpose-1534899.pdf> GRM188R61A226ME15D <https://www.mouser.com/datasheet/2/281/1/GRM188R61A226ME15_02A-1985787.pdf> GRM188R61E106MA73D <https://www.mouser.com/datasheet/2/281/1/GRM188R61E106MA73_01A-1985806.pdf> 885012006013 <https://www.mouser.com/datasheet/2/445/885012006013-1726946.pdf> 2220Y6300105KXTWS2 <https://www.mouser.com/datasheet/2/218/SMD_High_and_Std_StackiCap_P62-1825512.pdf> Yageo Class 2, X5R <https://www.mouser.com/datasheet/2/447/UPY_GPHC_X5R_4V_to_50V_26-1827097.pdf> TDK C Series <https://www.mouser.com/ProductDetail/TDK/C3216X5R1V226M160AC?qs=%2Fha2pyFadujbcx9jh7lYl%2F4NeMoXFhdc8AqVWNq4wW6M2y7zl6GzBuhgtI0ngznN> AVX Automotive MLCC <https://www.mouser.com/datasheet/2/40/AutoMLCC-777028.pdf> KEMET X7R Series <https://www.mouser.com/datasheet/2/212/KEM_C1002_X7R_SMD-1102033.pdf> Kyocera AVX <https://www.mouser.com/datasheet/2/40/C0GNP0_Dielectric-951274.pdf> GRM21BR61H <https://www.mouser.com/datasheet/2/281/1/GRM21BR61H106KE43_01A-1986884.pdf> C1812W104KDRACTU <https://www.mouser.com/datasheet/2/212/KEM_C1034_X7R_HV_ARC_SMD-1101730.pdf> CGA series - MLCC Automotive grade <https://product.tdk.com/system/files/dam/doc/product/capacitor/ceramic/mlcc/catalog/mlcc_automotive_general_en.pdf>; CAPACITANCE: 1nF; DKPN: 399-C0603C102K5RAC7867CT-ND; MANUFACTURER: KEMET; MOPN: 80-C0603C102K5R; MPN: C0603C102K5RACTU; TOLERANCE: 10%; VOLTAGE: 50V
C43 C52 = HyTechDevices:CAPACITOR_?_*: Capacitor, Non-Polarized VJ...1BC Series Datasheet <https://www.mouser.com/datasheet/2/427/vjw1bcbascomseries-1762447.pdf> Samsung Datasheet <https://www.mouser.com/datasheet/2/585/MLCC-1837944.pdf> Samsung Automotive MLCC Datasheet <https://www.mouser.com/datasheet/2/585/MLCC_Automotive-1837966.pdf> Walsin Datasheet <https://www.mouser.com/datasheet/2/210/WTC_MLCC_General_Purpose-1534899.pdf> GRM188R61A226ME15D <https://www.mouser.com/datasheet/2/281/1/GRM188R61A226ME15_02A-1985787.pdf> GRM188R61E106MA73D <https://www.mouser.com/datasheet/2/281/1/GRM188R61E106MA73_01A-1985806.pdf> 885012006013 <https://www.mouser.com/datasheet/2/445/885012006013-1726946.pdf> 2220Y6300105KXTWS2 <https://www.mouser.com/datasheet/2/218/SMD_High_and_Std_StackiCap_P62-1825512.pdf> Yageo Class 2, X5R <https://www.mouser.com/datasheet/2/447/UPY_GPHC_X5R_4V_to_50V_26-1827097.pdf> TDK C Series <https://www.mouser.com/ProductDetail/TDK/C3216X5R1V226M160AC?qs=%2Fha2pyFadujbcx9jh7lYl%2F4NeMoXFhdc8AqVWNq4wW6M2y7zl6GzBuhgtI0ngznN> AVX Automotive MLCC <https://www.mouser.com/datasheet/2/40/AutoMLCC-777028.pdf> KEMET X7R Series <https://www.mouser.com/datasheet/2/212/KEM_C1002_X7R_SMD-1102033.pdf> Kyocera AVX <https://www.mouser.com/datasheet/2/40/C0GNP0_Dielectric-951274.pdf> GRM21BR61H <https://www.mouser.com/datasheet/2/281/1/GRM21BR61H106KE43_01A-1986884.pdf> C1812W104KDRACTU <https://www.mouser.com/datasheet/2/212/KEM_C1034_X7R_HV_ARC_SMD-1101730.pdf> CGA series - MLCC Automotive grade <https://product.tdk.com/system/files/dam/doc/product/capacitor/ceramic/mlcc/catalog/mlcc_automotive_general_en.pdf>; CAPACITANCE: 10nF; DKPN: 311-1788-1-ND; MANUFACTURER: Yageo; MOPN: 603-CC603KRX7R0BB103; MPN: CC0603KRX7R0BB103; TOLERANCE: 10%; VOLTAGE: 100V
C54 = HyTechDevices:CAPACITOR_?_*: Capacitor, Non-Polarized VJ...1BC Series Datasheet <https://www.mouser.com/datasheet/2/427/vjw1bcbascomseries-1762447.pdf> Samsung Datasheet <https://www.mouser.com/datasheet/2/585/MLCC-1837944.pdf> Samsung Automotive MLCC Datasheet <https://www.mouser.com/datasheet/2/585/MLCC_Automotive-1837966.pdf> Walsin Datasheet <https://www.mouser.com/datasheet/2/210/WTC_MLCC_General_Purpose-1534899.pdf> GRM188R61A226ME15D <https://www.mouser.com/datasheet/2/281/1/GRM188R61A226ME15_02A-1985787.pdf> GRM188R61E106MA73D <https://www.mouser.com/datasheet/2/281/1/GRM188R61E106MA73_01A-1985806.pdf> 885012006013 <https://www.mouser.com/datasheet/2/445/885012006013-1726946.pdf> 2220Y6300105KXTWS2 <https://www.mouser.com/datasheet/2/218/SMD_High_and_Std_StackiCap_P62-1825512.pdf> Yageo Class 2, X5R <https://www.mouser.com/datasheet/2/447/UPY_GPHC_X5R_4V_to_50V_26-1827097.pdf> TDK C Series <https://www.mouser.com/ProductDetail/TDK/C3216X5R1V226M160AC?qs=%2Fha2pyFadujbcx9jh7lYl%2F4NeMoXFhdc8AqVWNq4wW6M2y7zl6GzBuhgtI0ngznN> AVX Automotive MLCC <https://www.mouser.com/datasheet/2/40/AutoMLCC-777028.pdf> KEMET X7R Series <https://www.mouser.com/datasheet/2/212/KEM_C1002_X7R_SMD-1102033.pdf> Kyocera AVX <https://www.mouser.com/datasheet/2/40/C0GNP0_Dielectric-951274.pdf> GRM21BR61H <https://www.mouser.com/datasheet/2/281/1/GRM21BR61H106KE43_01A-1986884.pdf> C1812W104KDRACTU <https://www.mouser.com/datasheet/2/212/KEM_C1034_X7R_HV_ARC_SMD-1101730.pdf> CGA series - MLCC Automotive grade <https://product.tdk.com/system/files/dam/doc/product/capacitor/ceramic/mlcc/catalog/mlcc_automotive_general_en.pdf>; CAPACITANCE: 47pF; DKPN: 490-5041-1-ND; MANUFACTURER: Murata Electronics; MOPN: 81-GCM31A7U2J470JX1D; MPN: GCM31A7U2J470JX01D; TOLERANCE: 5%; VOLTAGE: 630V
C55 = HyTechDevices:CAPACITOR_?_*: Capacitor, Non-Polarized VJ...1BC Series Datasheet <https://www.mouser.com/datasheet/2/427/vjw1bcbascomseries-1762447.pdf> Samsung Datasheet <https://www.mouser.com/datasheet/2/585/MLCC-1837944.pdf> Samsung Automotive MLCC Datasheet <https://www.mouser.com/datasheet/2/585/MLCC_Automotive-1837966.pdf> Walsin Datasheet <https://www.mouser.com/datasheet/2/210/WTC_MLCC_General_Purpose-1534899.pdf> GRM188R61A226ME15D <https://www.mouser.com/datasheet/2/281/1/GRM188R61A226ME15_02A-1985787.pdf> GRM188R61E106MA73D <https://www.mouser.com/datasheet/2/281/1/GRM188R61E106MA73_01A-1985806.pdf> 885012006013 <https://www.mouser.com/datasheet/2/445/885012006013-1726946.pdf> 2220Y6300105KXTWS2 <https://www.mouser.com/datasheet/2/218/SMD_High_and_Std_StackiCap_P62-1825512.pdf> Yageo Class 2, X5R <https://www.mouser.com/datasheet/2/447/UPY_GPHC_X5R_4V_to_50V_26-1827097.pdf> TDK C Series <https://www.mouser.com/ProductDetail/TDK/C3216X5R1V226M160AC?qs=%2Fha2pyFadujbcx9jh7lYl%2F4NeMoXFhdc8AqVWNq4wW6M2y7zl6GzBuhgtI0ngznN> AVX Automotive MLCC <https://www.mouser.com/datasheet/2/40/AutoMLCC-777028.pdf> KEMET X7R Series <https://www.mouser.com/datasheet/2/212/KEM_C1002_X7R_SMD-1102033.pdf> Kyocera AVX <https://www.mouser.com/datasheet/2/40/C0GNP0_Dielectric-951274.pdf> GRM21BR61H <https://www.mouser.com/datasheet/2/281/1/GRM21BR61H106KE43_01A-1986884.pdf> C1812W104KDRACTU <https://www.mouser.com/datasheet/2/212/KEM_C1034_X7R_HV_ARC_SMD-1101730.pdf> CGA series - MLCC Automotive grade <https://product.tdk.com/system/files/dam/doc/product/capacitor/ceramic/mlcc/catalog/mlcc_automotive_general_en.pdf>; CAPACITANCE: 10nF; DKPN: 445-9083-1-ND; MANUFACTURER: TDK Corporation; MOPN: 810-CGA5L4C0G2J103J; MPN: CGA5L4C0G2J103J160AA; TOLERANCE: 5%; VOLTAGE: 630V
C56 = HyTechDevices:CAPACITOR_?_*: Capacitor, Non-Polarized VJ...1BC Series Datasheet <https://www.mouser.com/datasheet/2/427/vjw1bcbascomseries-1762447.pdf> Samsung Datasheet <https://www.mouser.com/datasheet/2/585/MLCC-1837944.pdf> Samsung Automotive MLCC Datasheet <https://www.mouser.com/datasheet/2/585/MLCC_Automotive-1837966.pdf> Walsin Datasheet <https://www.mouser.com/datasheet/2/210/WTC_MLCC_General_Purpose-1534899.pdf> GRM188R61A226ME15D <https://www.mouser.com/datasheet/2/281/1/GRM188R61A226ME15_02A-1985787.pdf> GRM188R61E106MA73D <https://www.mouser.com/datasheet/2/281/1/GRM188R61E106MA73_01A-1985806.pdf> 885012006013 <https://www.mouser.com/datasheet/2/445/885012006013-1726946.pdf> 2220Y6300105KXTWS2 <https://www.mouser.com/datasheet/2/218/SMD_High_and_Std_StackiCap_P62-1825512.pdf> Yageo Class 2, X5R <https://www.mouser.com/datasheet/2/447/UPY_GPHC_X5R_4V_to_50V_26-1827097.pdf> TDK C Series <https://www.mouser.com/ProductDetail/TDK/C3216X5R1V226M160AC?qs=%2Fha2pyFadujbcx9jh7lYl%2F4NeMoXFhdc8AqVWNq4wW6M2y7zl6GzBuhgtI0ngznN> AVX Automotive MLCC <https://www.mouser.com/datasheet/2/40/AutoMLCC-777028.pdf> KEMET X7R Series <https://www.mouser.com/datasheet/2/212/KEM_C1002_X7R_SMD-1102033.pdf> Kyocera AVX <https://www.mouser.com/datasheet/2/40/C0GNP0_Dielectric-951274.pdf> GRM21BR61H <https://www.mouser.com/datasheet/2/281/1/GRM21BR61H106KE43_01A-1986884.pdf> C1812W104KDRACTU <https://www.mouser.com/datasheet/2/212/KEM_C1034_X7R_HV_ARC_SMD-1101730.pdf> CGA series - MLCC Automotive grade <https://product.tdk.com/system/files/dam/doc/product/capacitor/ceramic/mlcc/catalog/mlcc_automotive_general_en.pdf>; CAPACITANCE: 10nF; DKPN: 445-7404-1-ND; MANUFACTURER: TDK Corporation; MOPN: 810-C1608C0G1H103J; MPN: C1608C0G1H103J080AA; TOLERANCE: 5%; VOLTAGE: 50V
D2 = HyTechDevices:SCHOTTKY_?_*: CUS08F30 Shottky Diode Datasheet <https://www.mouser.com/datasheet/2/408/CUS08F30_datasheet_en_20140414-1916097.pdf> CMDSH2-3 Shottky Diode Datasheet <https://www.mouser.com/datasheet/2/68/cmdsh2-3-39086.pdf>; CURRENT: 0.2A; DKPN: 1514-CMDSH2-3TRPBFREECT-ND; MANUFACTURER: Central Semiconductor Corp; MOPN: 610-CMDSH2-3; MPN: CMDSH2-3 TR PBFREE; VOLTAGE: 30V
D3 D4 = HyTechDevices:LED_?_*: LED 0603 Blue <https://www.mouser.com/datasheet/2/216/APT1608VBC_D-246010.pdf> Green <https://www.mouser.com/datasheet/2/216/APT1608ZGCK-1173388.pdf> Orange <https://www.mouser.com/datasheet/2/216/APT1608SECK-6197.pdf> Red <https://www.mouser.com/datasheet/2/216/APT1608SECK-J3-PRV-1173336.pdf> White <https://www.mouser.com/datasheet/2/50/SM0603UWC-880813.pdf> Yellow <https://www.mouser.com/datasheet/2/216/APT1608SYCK-J3-PRV-1173311.pdf> 2835 (Series not on Digikey) Lumiled LUXEON 2835 Color Line <https://www.mouser.com/datasheet/2/602/DS236_luxeon_2835_color_line_datasheet-1596094.pdf>; COLOR: Blue; DKPN: 754-1789-1-ND; MANUFACTURER: Kingbright; MOPN: 604-APT1608VBC/D; MPN: APT1608VBC/D
D5 = HyTechDevices:LED_?_*: LED 0603 Blue <https://www.mouser.com/datasheet/2/216/APT1608VBC_D-246010.pdf> Green <https://www.mouser.com/datasheet/2/216/APT1608ZGCK-1173388.pdf> Orange <https://www.mouser.com/datasheet/2/216/APT1608SECK-6197.pdf> Red <https://www.mouser.com/datasheet/2/216/APT1608SECK-J3-PRV-1173336.pdf> White <https://www.mouser.com/datasheet/2/50/SM0603UWC-880813.pdf> Yellow <https://www.mouser.com/datasheet/2/216/APT1608SYCK-J3-PRV-1173311.pdf> 2835 (Series not on Digikey) Lumiled LUXEON 2835 Color Line <https://www.mouser.com/datasheet/2/602/DS236_luxeon_2835_color_line_datasheet-1596094.pdf>; COLOR: Orange; DKPN: 754-1120-1-ND; MANUFACTURER: Kingbright; MOPN: 604-APT1608SECK; MPN: APT1608SECK
D6 LED_+12V1 = HyTechDevices:LED_?_*: LED 0603 Blue <https://www.mouser.com/datasheet/2/216/APT1608VBC_D-246010.pdf> Green <https://www.mouser.com/datasheet/2/216/APT1608ZGCK-1173388.pdf> Orange <https://www.mouser.com/datasheet/2/216/APT1608SECK-6197.pdf> Red <https://www.mouser.com/datasheet/2/216/APT1608SECK-J3-PRV-1173336.pdf> White <https://www.mouser.com/datasheet/2/50/SM0603UWC-880813.pdf> Yellow <https://www.mouser.com/datasheet/2/216/APT1608SYCK-J3-PRV-1173311.pdf> 2835 (Series not on Digikey) Lumiled LUXEON 2835 Color Line <https://www.mouser.com/datasheet/2/602/DS236_luxeon_2835_color_line_datasheet-1596094.pdf>; COLOR: Green; DKPN: 754-1790-1-ND; MANUFACTURER: Kingbright; MOPN: 604-APT1608ZGCK; MPN: APT1608ZGCK
D7 = HyTechDevices:TVS_?_*: TVS Diode GSOT Datasheet <https://www.mouser.com/datasheet/2/427/gsot03-1767593.pdf>; DKPN: GSOT08-E3-08TR-ND; MANUFACTURER: Vishay General Semiconductor - Diodes Division; MOPN: 78-GSOT08-E3-08; MPN: GSOT08-E3-08; VOLTAGE: 8V
D8 = HyTechDevices:LED_?_*: LED 0603 Blue <https://www.mouser.com/datasheet/2/216/APT1608VBC_D-246010.pdf> Green <https://www.mouser.com/datasheet/2/216/APT1608ZGCK-1173388.pdf> Orange <https://www.mouser.com/datasheet/2/216/APT1608SECK-6197.pdf> Red <https://www.mouser.com/datasheet/2/216/APT1608SECK-J3-PRV-1173336.pdf> White <https://www.mouser.com/datasheet/2/50/SM0603UWC-880813.pdf> Yellow <https://www.mouser.com/datasheet/2/216/APT1608SYCK-J3-PRV-1173311.pdf> 2835 (Series not on Digikey) Lumiled LUXEON 2835 Color Line <https://www.mouser.com/datasheet/2/602/DS236_luxeon_2835_color_line_datasheet-1596094.pdf>; COLOR: Yellow; DKPN: 754-1788-1-ND; MANUFACTURER: Kingbright; MOPN: 604-APT1608SYCK/J3-PRV; MPN: APT1608SYCK/J3-PRV
D9-D11 = HyTechDevices:RECTIFIER_*_?: Diodes Incorporated US1GWF Datasheet <https://www.mouser.com/datasheet/2/115/DIOD_S_A0003383552_1-2542294.pdf> Diodes Incorporated US1M Datasheet <https://www.diodes.com/assets/Datasheets/ds16008.pdf> onsemi US1KFA Datasheet <https://www.onsemi.com/pdf/datasheet/us1mfa-d.pdf>; CURRENT: 1A; DKPN: US1KFACT-ND; MANUFACTURER: onsemi; MOPN: 512-US1KFA; MPN: US1KFA; VOLTAGE: 800V
D12 = HyTechDevices:ZENER_?_*: Zener Diode 1SMB5949B-13 <https://www.diodes.com/assets/Datasheets/ds32125.pdf> SMBJ5350B-TP <https://www.mccsemi.com/pdf/Products/SMBJ5338B-SMBJ5388B(SMB).pdf>; CURRENT: 0.385A; DKPN: SMBJ5350B-TPMSCT-ND; MANUFACTURER: Micro Commercial Co; MOPN: 833-SMBJ5350B-TP; MPN: SMBJ5350B-TP; VOLTAGE: 13V
D100 = HyTechDevices:SCHOTTKY_?_*: CUS08F30 Shottky Diode Datasheet <https://www.mouser.com/datasheet/2/408/CUS08F30_datasheet_en_20140414-1916097.pdf> CMDSH2-3 Shottky Diode Datasheet <https://www.mouser.com/datasheet/2/68/cmdsh2-3-39086.pdf>; CURRENT: 1A; DKPN: 3757-MBR1060HEWS_R1_00001TR-ND; MANUFACTURER: Panjit International Inc.; MOPN: 241-MBR1060HEWSR1000; MPN: MBR1060HEWS_R1_00001; VOLTAGE: 60V
F1 F2 = HyTechDevices:FUSE_HOLDER_*: Fuse Holder All PNs for the holder; if Miniblade Fuses <https://www.littelfuse.com/media?resourcetype=datasheets&itemid=0f5f58cb-559e-494b-8d53-723f30445ae5&filename=littelfuse-mini-datasheet> needed, order separately. Mini-Blade PTH <https://www.mouser.com/datasheet/2/215/3568-742601.pdf> Mini-Blade SMD <https://www.mouser.com/datasheet/2/215/588-744913.pdf> Littelfuse 122 Fuse Holder and Fuse Fuse <https://www.littelfuse.com/~/media/electronics/datasheets/fuses/littelfuse_fuse_508_datasheet.pdf.pdf> Fuse Holder <https://www.littelfuse.com/~/media/electronics/datasheets/fuse_clips/littelfuse_fuse_clip_102_122_datasheet.pdf.pdf>; DKPN: F3783-ND; FUSE_TYPE: 1 1/4" Cartridge; MANUFACTURER: Littelfuse; MOPN: 576-01220088Z; MPN: 01220088Z
K1 = HyTechDevices:RELAY_SPST_NO_?*: Single Pole, Single Throw Relay Normally Open 355x Series <https://www.comus-intl.com/wp-content/uploads/2017/01/High-Voltage-Reed-Relays.pdf> D Series <https://www.mouser.com/datasheet/2/657/cynergy3_d_pcb_v2-1892244.pdf>; DKPN: 725-1048-ND; MANUFACTURER: Sensata-Cynergy3; MOPN: 285-DAR72410; MPN: DAR72410
L1 = HyTechDevices:INDUCTOR_?_*: Inductor LQM18DH100M70 Datasheet <https://search.murata.co.jp/Ceramy/image/img/P02/JELF243B-9127.pdf> 74451133 Datasheet <https://www.we-online.com/catalog/datasheet/74451133.pdf> SRU1408 Datasheet <https://www.mouser.com/datasheet/2/54/SRU1048-1391431.pdf> PA4334 Datasheet <https://www.mouser.com/datasheet/2/336/plei_s_a0002827602_1-2281222.pdf> WE-LMHI Datasheet <https://www.mouser.com/datasheet/2/445/74437349560-1721693.pdf> SRR0745A Datasheet <https://www.bourns.com/docs/Product-Datasheets/SRR0745A.pdf>; CURRENT_RATED: 200mA; CURRENT_SATURATION: 240mA; DCR: 4.1Ω; DKPN: SRR0745A-102MCT-ND; INDUCTANCE: 1mH; MANUFACTURER: Bourns Inc.; MOPN: 652-SRR0745A-102M; MPN: SRR0745A-102M; TOLERANCE: 20%
Q2 = HyTechDevices:TRANSISTOR_N_MOS_?_*: N-MOSFET PMV15ENEA Datasheet <https://www.mouser.com/datasheet/2/916/PMV15ENEA-1604828.pdf> TK6P65W Datasheet <https://www.mouser.com/datasheet/2/408/TK6P65W_datasheet_en_20151225-1916290.pdf> SIR638ADP Datasheet <https://www.mouser.com/datasheet/2/427/sir638adp-1766131.pdf> DMG3406L Datasheet <https://www.diodes.com/assets/Datasheets/DMG3406L.pdf> STL2N80K5 <https://www.mouser.com/datasheet/2/389/dm00092662-1798082.pdf>; DKPN: 1727-8588-1-ND; MANUFACTURER: Nexperia USA Inc.; MOPN: 771-PMV15ENEAR; MPN: PMV15ENEAR
R1 R20 R42 = HyTechDevices:RESISTOR_?_*: Resistor PWR163 Series <https://www.mouser.com/datasheet/2/54/pwr163-777985.pdf> AC Series <https://www.mouser.com/datasheet/2/447/Yageo_PYu_AC_51_RoHS_L_7_1714230-1874691.pdf> PU Series <https://www.mouser.com/datasheet/2/447/PYu-PU_51_RoHS_L_6-1504619.pdf> UCR Series <https://fscdn.rohm.com/en/products/databook/datasheet/passive/resistor/chip_resistor/ucr-e.pdf> ERA Series <https://www.mouser.com/datasheet/2/315/AOA0000C307-1149632.pdf> PWR263 Series <https://www.mouser.com/datasheet/2/54/pwr263s_35-778069.pdf> KTR Series <https://www.mouser.com/datasheet/2/348/ROHM_S_A0011075115_1-2563276.pdf> RC Series <https://www.mouser.com/datasheet/2/447/Yageo_03_18_2021_PYu_RC_Group_51_RoHS_L_11-2199992.pdf> ERJ Low Resistance Series <https://www.mouser.com/datasheet/2/315/AOA0000C313-1141758.pdf> ERJ PB3, PB6 Series <https://www.mouser.com/datasheet/2/315/AOA0000C328-1530132.pdf> ERJ PA2, P03, PA3, P06, P08, P14 Series <https://www.mouser.com/datasheet/2/315/AOA0000C331-1141874.pdf> B20 Series <https://www.ohmite.com/assets/docs/res_200.pdf?r=false> TE Connectivity/Holsworthy RN73 Series <https://www.mouser.com/datasheet/2/418/4/NG_DS_1773270_M-604713.pdf> Vishay Dale D/CRCW e3 <https://www.mouser.com/datasheet/2/427/dcrcwe3-1762152.pdf> Ohmite B20 <https://www.ohmite.com/assets/docs/res_200.pdf?r=false>; RESISTANCE: DNP
R13 R23 = HyTechDevices:RESISTOR_?_*: Resistor PWR163 Series <https://www.mouser.com/datasheet/2/54/pwr163-777985.pdf> AC Series <https://www.mouser.com/datasheet/2/447/Yageo_PYu_AC_51_RoHS_L_7_1714230-1874691.pdf> PU Series <https://www.mouser.com/datasheet/2/447/PYu-PU_51_RoHS_L_6-1504619.pdf> UCR Series <https://fscdn.rohm.com/en/products/databook/datasheet/passive/resistor/chip_resistor/ucr-e.pdf> ERA Series <https://www.mouser.com/datasheet/2/315/AOA0000C307-1149632.pdf> PWR263 Series <https://www.mouser.com/datasheet/2/54/pwr263s_35-778069.pdf> KTR Series <https://www.mouser.com/datasheet/2/348/ROHM_S_A0011075115_1-2563276.pdf> RC Series <https://www.mouser.com/datasheet/2/447/Yageo_03_18_2021_PYu_RC_Group_51_RoHS_L_11-2199992.pdf> ERJ Low Resistance Series <https://www.mouser.com/datasheet/2/315/AOA0000C313-1141758.pdf> ERJ PB3, PB6 Series <https://www.mouser.com/datasheet/2/315/AOA0000C328-1530132.pdf> ERJ PA2, P03, PA3, P06, P08, P14 Series <https://www.mouser.com/datasheet/2/315/AOA0000C331-1141874.pdf> B20 Series <https://www.ohmite.com/assets/docs/res_200.pdf?r=false> TE Connectivity/Holsworthy RN73 Series <https://www.mouser.com/datasheet/2/418/4/NG_DS_1773270_M-604713.pdf> Vishay Dale D/CRCW e3 <https://www.mouser.com/datasheet/2/427/dcrcwe3-1762152.pdf> Ohmite B20 <https://www.ohmite.com/assets/docs/res_200.pdf?r=false>; DKPN: B20J1K5E-ND; MANUFACTURER: Ohmite; MOPN: 588-B20J1K5E; MPN: B20J1K5E; POWER: 20W; RESISTANCE: 1.5K; TOLERANCE: 5%; VOLTAGE_CONTINUOUS: 173V; VOLTAGE_MAX: 750V
R15 = HyTechDevices:RESISTOR_?_*: Resistor PWR163 Series <https://www.mouser.com/datasheet/2/54/pwr163-777985.pdf> AC Series <https://www.mouser.com/datasheet/2/447/Yageo_PYu_AC_51_RoHS_L_7_1714230-1874691.pdf> PU Series <https://www.mouser.com/datasheet/2/447/PYu-PU_51_RoHS_L_6-1504619.pdf> UCR Series <https://fscdn.rohm.com/en/products/databook/datasheet/passive/resistor/chip_resistor/ucr-e.pdf> ERA Series <https://www.mouser.com/datasheet/2/315/AOA0000C307-1149632.pdf> PWR263 Series <https://www.mouser.com/datasheet/2/54/pwr263s_35-778069.pdf> KTR Series <https://www.mouser.com/datasheet/2/348/ROHM_S_A0011075115_1-2563276.pdf> RC Series <https://www.mouser.com/datasheet/2/447/Yageo_03_18_2021_PYu_RC_Group_51_RoHS_L_11-2199992.pdf> ERJ Low Resistance Series <https://www.mouser.com/datasheet/2/315/AOA0000C313-1141758.pdf> ERJ PB3, PB6 Series <https://www.mouser.com/datasheet/2/315/AOA0000C328-1530132.pdf> ERJ PA2, P03, PA3, P06, P08, P14 Series <https://www.mouser.com/datasheet/2/315/AOA0000C331-1141874.pdf> B20 Series <https://www.ohmite.com/assets/docs/res_200.pdf?r=false> TE Connectivity/Holsworthy RN73 Series <https://www.mouser.com/datasheet/2/418/4/NG_DS_1773270_M-604713.pdf> Vishay Dale D/CRCW e3 <https://www.mouser.com/datasheet/2/427/dcrcwe3-1762152.pdf> Ohmite B20 <https://www.ohmite.com/assets/docs/res_200.pdf?r=false>; DKPN: RT0603BRB0714KL-ND; MANUFACTURER: YAGEO; MOPN: 603-RT0603BRB0714KL; MPN: RT0603BRB0714KL; POWER: 0.1W; RESISTANCE: 14k; TOLERANCE: 0.1%; VOLTAGE_CONTINUOUS: 37.4V; VOLTAGE_MAX: 75V
R18 = HyTechDevices:RESISTOR_?_*: Resistor PWR163 Series <https://www.mouser.com/datasheet/2/54/pwr163-777985.pdf> AC Series <https://www.mouser.com/datasheet/2/447/Yageo_PYu_AC_51_RoHS_L_7_1714230-1874691.pdf> PU Series <https://www.mouser.com/datasheet/2/447/PYu-PU_51_RoHS_L_6-1504619.pdf> UCR Series <https://fscdn.rohm.com/en/products/databook/datasheet/passive/resistor/chip_resistor/ucr-e.pdf> ERA Series <https://www.mouser.com/datasheet/2/315/AOA0000C307-1149632.pdf> PWR263 Series <https://www.mouser.com/datasheet/2/54/pwr263s_35-778069.pdf> KTR Series <https://www.mouser.com/datasheet/2/348/ROHM_S_A0011075115_1-2563276.pdf> RC Series <https://www.mouser.com/datasheet/2/447/Yageo_03_18_2021_PYu_RC_Group_51_RoHS_L_11-2199992.pdf> ERJ Low Resistance Series <https://www.mouser.com/datasheet/2/315/AOA0000C313-1141758.pdf> ERJ PB3, PB6 Series <https://www.mouser.com/datasheet/2/315/AOA0000C328-1530132.pdf> ERJ PA2, P03, PA3, P06, P08, P14 Series <https://www.mouser.com/datasheet/2/315/AOA0000C331-1141874.pdf> B20 Series <https://www.ohmite.com/assets/docs/res_200.pdf?r=false> TE Connectivity/Holsworthy RN73 Series <https://www.mouser.com/datasheet/2/418/4/NG_DS_1773270_M-604713.pdf> Vishay Dale D/CRCW e3 <https://www.mouser.com/datasheet/2/427/dcrcwe3-1762152.pdf> Ohmite B20 <https://www.ohmite.com/assets/docs/res_200.pdf?r=false>; DKPN: 311-1.65KHRCT-ND; MANUFACTURER: Yageo; MOPN: 603-RC0603FR-071K65L; MPN: RC0603FR-071K65L; POWER: 0.1W; RESISTANCE: 1.65k; TOLERANCE: 1%; VOLTAGE_CONTINUOUS: 12.85V; VOLTAGE_MAX: 75V
R24 = HyTechDevices:RESISTOR_?_*: Resistor PWR163 Series <https://www.mouser.com/datasheet/2/54/pwr163-777985.pdf> AC Series <https://www.mouser.com/datasheet/2/447/Yageo_PYu_AC_51_RoHS_L_7_1714230-1874691.pdf> PU Series <https://www.mouser.com/datasheet/2/447/PYu-PU_51_RoHS_L_6-1504619.pdf> UCR Series <https://fscdn.rohm.com/en/products/databook/datasheet/passive/resistor/chip_resistor/ucr-e.pdf> ERA Series <https://www.mouser.com/datasheet/2/315/AOA0000C307-1149632.pdf> PWR263 Series <https://www.mouser.com/datasheet/2/54/pwr263s_35-778069.pdf> KTR Series <https://www.mouser.com/datasheet/2/348/ROHM_S_A0011075115_1-2563276.pdf> RC Series <https://www.mouser.com/datasheet/2/447/Yageo_03_18_2021_PYu_RC_Group_51_RoHS_L_11-2199992.pdf> ERJ Low Resistance Series <https://www.mouser.com/datasheet/2/315/AOA0000C313-1141758.pdf> ERJ PB3, PB6 Series <https://www.mouser.com/datasheet/2/315/AOA0000C328-1530132.pdf> ERJ PA2, P03, PA3, P06, P08, P14 Series <https://www.mouser.com/datasheet/2/315/AOA0000C331-1141874.pdf> B20 Series <https://www.ohmite.com/assets/docs/res_200.pdf?r=false> TE Connectivity/Holsworthy RN73 Series <https://www.mouser.com/datasheet/2/418/4/NG_DS_1773270_M-604713.pdf> Vishay Dale D/CRCW e3 <https://www.mouser.com/datasheet/2/427/dcrcwe3-1762152.pdf> Ohmite B20 <https://www.ohmite.com/assets/docs/res_200.pdf?r=false>; DKPN: 13-RT0603BRD0739RLTR-ND; MANUFACTURER: Yageo; MOPN: 603-RT0603BRD0739RL; MPN: RT0603BRD0739RL; POWER: 0.1W; RESISTANCE: 39; TOLERANCE: 1%; VOLTAGE_CONTINUOUS: 1.97V; VOLTAGE_MAX: 75V
R25 R27 = HyTechDevices:RESISTOR_?_*: Resistor PWR163 Series <https://www.mouser.com/datasheet/2/54/pwr163-777985.pdf> AC Series <https://www.mouser.com/datasheet/2/447/Yageo_PYu_AC_51_RoHS_L_7_1714230-1874691.pdf> PU Series <https://www.mouser.com/datasheet/2/447/PYu-PU_51_RoHS_L_6-1504619.pdf> UCR Series <https://fscdn.rohm.com/en/products/databook/datasheet/passive/resistor/chip_resistor/ucr-e.pdf> ERA Series <https://www.mouser.com/datasheet/2/315/AOA0000C307-1149632.pdf> PWR263 Series <https://www.mouser.com/datasheet/2/54/pwr263s_35-778069.pdf> KTR Series <https://www.mouser.com/datasheet/2/348/ROHM_S_A0011075115_1-2563276.pdf> RC Series <https://www.mouser.com/datasheet/2/447/Yageo_03_18_2021_PYu_RC_Group_51_RoHS_L_11-2199992.pdf> ERJ Low Resistance Series <https://www.mouser.com/datasheet/2/315/AOA0000C313-1141758.pdf> ERJ PB3, PB6 Series <https://www.mouser.com/datasheet/2/315/AOA0000C328-1530132.pdf> ERJ PA2, P03, PA3, P06, P08, P14 Series <https://www.mouser.com/datasheet/2/315/AOA0000C331-1141874.pdf> B20 Series <https://www.ohmite.com/assets/docs/res_200.pdf?r=false> TE Connectivity/Holsworthy RN73 Series <https://www.mouser.com/datasheet/2/418/4/NG_DS_1773270_M-604713.pdf> Vishay Dale D/CRCW e3 <https://www.mouser.com/datasheet/2/427/dcrcwe3-1762152.pdf> Ohmite B20 <https://www.ohmite.com/assets/docs/res_200.pdf?r=false>; DKPN: 10-ERJ-UP3F2001VTR-ND; MANUFACTURER: Panasonic Electronic Components; MOPN: 667-ERJ-UP3F2001V; MPN: ERJ-UP3F2001V; POWER: 0.25W; RESISTANCE: 2k; TOLERANCE: 1%; VOLTAGE_CONTINUOUS: 22.36V; VOLTAGE_MAX: 150V
R26 R29 R31 R50 = HyTechDevices:RESISTOR_?_*: Resistor PWR163 Series <https://www.mouser.com/datasheet/2/54/pwr163-777985.pdf> AC Series <https://www.mouser.com/datasheet/2/447/Yageo_PYu_AC_51_RoHS_L_7_1714230-1874691.pdf> PU Series <https://www.mouser.com/datasheet/2/447/PYu-PU_51_RoHS_L_6-1504619.pdf> UCR Series <https://fscdn.rohm.com/en/products/databook/datasheet/passive/resistor/chip_resistor/ucr-e.pdf> ERA Series <https://www.mouser.com/datasheet/2/315/AOA0000C307-1149632.pdf> PWR263 Series <https://www.mouser.com/datasheet/2/54/pwr263s_35-778069.pdf> KTR Series <https://www.mouser.com/datasheet/2/348/ROHM_S_A0011075115_1-2563276.pdf> RC Series <https://www.mouser.com/datasheet/2/447/Yageo_03_18_2021_PYu_RC_Group_51_RoHS_L_11-2199992.pdf> ERJ Low Resistance Series <https://www.mouser.com/datasheet/2/315/AOA0000C313-1141758.pdf> ERJ PB3, PB6 Series <https://www.mouser.com/datasheet/2/315/AOA0000C328-1530132.pdf> ERJ PA2, P03, PA3, P06, P08, P14 Series <https://www.mouser.com/datasheet/2/315/AOA0000C331-1141874.pdf> B20 Series <https://www.ohmite.com/assets/docs/res_200.pdf?r=false> TE Connectivity/Holsworthy RN73 Series <https://www.mouser.com/datasheet/2/418/4/NG_DS_1773270_M-604713.pdf> Vishay Dale D/CRCW e3 <https://www.mouser.com/datasheet/2/427/dcrcwe3-1762152.pdf> Ohmite B20 <https://www.ohmite.com/assets/docs/res_200.pdf?r=false>; DKPN: 1712-CPF-A-0603B1K0ETR-ND; MANUFACTURER: TE Connectivity Passive Product; MOPN: 279-CPF-A-0603B1K0E; MPN: CPF-A-0603B1K0E; POWER: 0.0625W; RESISTANCE: 1k; TOLERANCE: 0.1%; VOLTAGE_CONTINUOUS: 7.9V; VOLTAGE_MAX: 50V
R28 = HyTechDevices:RESISTOR_?_*: Resistor PWR163 Series <https://www.mouser.com/datasheet/2/54/pwr163-777985.pdf> AC Series <https://www.mouser.com/datasheet/2/447/Yageo_PYu_AC_51_RoHS_L_7_1714230-1874691.pdf> PU Series <https://www.mouser.com/datasheet/2/447/PYu-PU_51_RoHS_L_6-1504619.pdf> UCR Series <https://fscdn.rohm.com/en/products/databook/datasheet/passive/resistor/chip_resistor/ucr-e.pdf> ERA Series <https://www.mouser.com/datasheet/2/315/AOA0000C307-1149632.pdf> PWR263 Series <https://www.mouser.com/datasheet/2/54/pwr263s_35-778069.pdf> KTR Series <https://www.mouser.com/datasheet/2/348/ROHM_S_A0011075115_1-2563276.pdf> RC Series <https://www.mouser.com/datasheet/2/447/Yageo_03_18_2021_PYu_RC_Group_51_RoHS_L_11-2199992.pdf> ERJ Low Resistance Series <https://www.mouser.com/datasheet/2/315/AOA0000C313-1141758.pdf> ERJ PB3, PB6 Series <https://www.mouser.com/datasheet/2/315/AOA0000C328-1530132.pdf> ERJ PA2, P03, PA3, P06, P08, P14 Series <https://www.mouser.com/datasheet/2/315/AOA0000C331-1141874.pdf> B20 Series <https://www.ohmite.com/assets/docs/res_200.pdf?r=false> TE Connectivity/Holsworthy RN73 Series <https://www.mouser.com/datasheet/2/418/4/NG_DS_1773270_M-604713.pdf> Vishay Dale D/CRCW e3 <https://www.mouser.com/datasheet/2/427/dcrcwe3-1762152.pdf> Ohmite B20 <https://www.ohmite.com/assets/docs/res_200.pdf?r=false>; DKPN: P10KBDCT-ND; MANUFACTURER: Panasonic Electronic Components; MOPN: 667-ERA-3ARB103V; MPN: ERA-3ARB103V; POWER: 0.1W; RESISTANCE: 10k; TOLERANCE: 0.1%; VOLTAGE_CONTINUOUS: 31.62V; VOLTAGE_MAX: 75V
R30 = HyTechDevices:RESISTOR_?_*: Resistor PWR163 Series <https://www.mouser.com/datasheet/2/54/pwr163-777985.pdf> AC Series <https://www.mouser.com/datasheet/2/447/Yageo_PYu_AC_51_RoHS_L_7_1714230-1874691.pdf> PU Series <https://www.mouser.com/datasheet/2/447/PYu-PU_51_RoHS_L_6-1504619.pdf> UCR Series <https://fscdn.rohm.com/en/products/databook/datasheet/passive/resistor/chip_resistor/ucr-e.pdf> ERA Series <https://www.mouser.com/datasheet/2/315/AOA0000C307-1149632.pdf> PWR263 Series <https://www.mouser.com/datasheet/2/54/pwr263s_35-778069.pdf> KTR Series <https://www.mouser.com/datasheet/2/348/ROHM_S_A0011075115_1-2563276.pdf> RC Series <https://www.mouser.com/datasheet/2/447/Yageo_03_18_2021_PYu_RC_Group_51_RoHS_L_11-2199992.pdf> ERJ Low Resistance Series <https://www.mouser.com/datasheet/2/315/AOA0000C313-1141758.pdf> ERJ PB3, PB6 Series <https://www.mouser.com/datasheet/2/315/AOA0000C328-1530132.pdf> ERJ PA2, P03, PA3, P06, P08, P14 Series <https://www.mouser.com/datasheet/2/315/AOA0000C331-1141874.pdf> B20 Series <https://www.ohmite.com/assets/docs/res_200.pdf?r=false> TE Connectivity/Holsworthy RN73 Series <https://www.mouser.com/datasheet/2/418/4/NG_DS_1773270_M-604713.pdf> Vishay Dale D/CRCW e3 <https://www.mouser.com/datasheet/2/427/dcrcwe3-1762152.pdf> Ohmite B20 <https://www.ohmite.com/assets/docs/res_200.pdf?r=false>; DKPN: P20340TR-ND; MANUFACTURER: Panasonic Electronic Components; MOPN: 667-ERJ-PB3D3301V; MPN: ERJ-PB3D3301V; POWER: 0.3W; RESISTANCE: 3.3k; TOLERANCE: 0.5%; VOLTAGE_CONTINUOUS: 25.69V; VOLTAGE_MAX: 150
R32 = HyTechDevices:RESISTOR_?_*: Resistor PWR163 Series <https://www.mouser.com/datasheet/2/54/pwr163-777985.pdf> AC Series <https://www.mouser.com/datasheet/2/447/Yageo_PYu_AC_51_RoHS_L_7_1714230-1874691.pdf> PU Series <https://www.mouser.com/datasheet/2/447/PYu-PU_51_RoHS_L_6-1504619.pdf> UCR Series <https://fscdn.rohm.com/en/products/databook/datasheet/passive/resistor/chip_resistor/ucr-e.pdf> ERA Series <https://www.mouser.com/datasheet/2/315/AOA0000C307-1149632.pdf> PWR263 Series <https://www.mouser.com/datasheet/2/54/pwr263s_35-778069.pdf> KTR Series <https://www.mouser.com/datasheet/2/348/ROHM_S_A0011075115_1-2563276.pdf> RC Series <https://www.mouser.com/datasheet/2/447/Yageo_03_18_2021_PYu_RC_Group_51_RoHS_L_11-2199992.pdf> ERJ Low Resistance Series <https://www.mouser.com/datasheet/2/315/AOA0000C313-1141758.pdf> ERJ PB3, PB6 Series <https://www.mouser.com/datasheet/2/315/AOA0000C328-1530132.pdf> ERJ PA2, P03, PA3, P06, P08, P14 Series <https://www.mouser.com/datasheet/2/315/AOA0000C331-1141874.pdf> B20 Series <https://www.ohmite.com/assets/docs/res_200.pdf?r=false> TE Connectivity/Holsworthy RN73 Series <https://www.mouser.com/datasheet/2/418/4/NG_DS_1773270_M-604713.pdf> Vishay Dale D/CRCW e3 <https://www.mouser.com/datasheet/2/427/dcrcwe3-1762152.pdf> Ohmite B20 <https://www.ohmite.com/assets/docs/res_200.pdf?r=false>; DKPN: RT0603BRE0775KL-ND; MANUFACTURER: Yageo; MOPN: 603-RT0603BRE0775KL; MPN: RT0603BRE0775KL; POWER: 0.1W; RESISTANCE: 75k; TOLERANCE: 0.1%; VOLTAGE_CONTINUOUS: 75V; VOLTAGE_MAX: 75V
R33 = HyTechDevices:RESISTOR_?_*: Resistor PWR163 Series <https://www.mouser.com/datasheet/2/54/pwr163-777985.pdf> AC Series <https://www.mouser.com/datasheet/2/447/Yageo_PYu_AC_51_RoHS_L_7_1714230-1874691.pdf> PU Series <https://www.mouser.com/datasheet/2/447/PYu-PU_51_RoHS_L_6-1504619.pdf> UCR Series <https://fscdn.rohm.com/en/products/databook/datasheet/passive/resistor/chip_resistor/ucr-e.pdf> ERA Series <https://www.mouser.com/datasheet/2/315/AOA0000C307-1149632.pdf> PWR263 Series <https://www.mouser.com/datasheet/2/54/pwr263s_35-778069.pdf> KTR Series <https://www.mouser.com/datasheet/2/348/ROHM_S_A0011075115_1-2563276.pdf> RC Series <https://www.mouser.com/datasheet/2/447/Yageo_03_18_2021_PYu_RC_Group_51_RoHS_L_11-2199992.pdf> ERJ Low Resistance Series <https://www.mouser.com/datasheet/2/315/AOA0000C313-1141758.pdf> ERJ PB3, PB6 Series <https://www.mouser.com/datasheet/2/315/AOA0000C328-1530132.pdf> ERJ PA2, P03, PA3, P06, P08, P14 Series <https://www.mouser.com/datasheet/2/315/AOA0000C331-1141874.pdf> B20 Series <https://www.ohmite.com/assets/docs/res_200.pdf?r=false> TE Connectivity/Holsworthy RN73 Series <https://www.mouser.com/datasheet/2/418/4/NG_DS_1773270_M-604713.pdf> Vishay Dale D/CRCW e3 <https://www.mouser.com/datasheet/2/427/dcrcwe3-1762152.pdf> Ohmite B20 <https://www.ohmite.com/assets/docs/res_200.pdf?r=false>; DKPN: 311-10.0HRCT-ND; MANUFACTURER: Yageo; MOPN: 603-RC0603FR-0710RL; MPN: RC0603FR-0710RL; POWER: 0.1W; RESISTANCE: 10; TOLERANCE: 1%; VOLTAGE_CONTINUOUS: 1.00V; VOLTAGE_MAX: 75V
R34 = HyTechDevices:RESISTOR_?_*: Resistor PWR163 Series <https://www.mouser.com/datasheet/2/54/pwr163-777985.pdf> AC Series <https://www.mouser.com/datasheet/2/447/Yageo_PYu_AC_51_RoHS_L_7_1714230-1874691.pdf> PU Series <https://www.mouser.com/datasheet/2/447/PYu-PU_51_RoHS_L_6-1504619.pdf> UCR Series <https://fscdn.rohm.com/en/products/databook/datasheet/passive/resistor/chip_resistor/ucr-e.pdf> ERA Series <https://www.mouser.com/datasheet/2/315/AOA0000C307-1149632.pdf> PWR263 Series <https://www.mouser.com/datasheet/2/54/pwr263s_35-778069.pdf> KTR Series <https://www.mouser.com/datasheet/2/348/ROHM_S_A0011075115_1-2563276.pdf> RC Series <https://www.mouser.com/datasheet/2/447/Yageo_03_18_2021_PYu_RC_Group_51_RoHS_L_11-2199992.pdf> ERJ Low Resistance Series <https://www.mouser.com/datasheet/2/315/AOA0000C313-1141758.pdf> ERJ PB3, PB6 Series <https://www.mouser.com/datasheet/2/315/AOA0000C328-1530132.pdf> ERJ PA2, P03, PA3, P06, P08, P14 Series <https://www.mouser.com/datasheet/2/315/AOA0000C331-1141874.pdf> B20 Series <https://www.ohmite.com/assets/docs/res_200.pdf?r=false> TE Connectivity/Holsworthy RN73 Series <https://www.mouser.com/datasheet/2/418/4/NG_DS_1773270_M-604713.pdf> Vishay Dale D/CRCW e3 <https://www.mouser.com/datasheet/2/427/dcrcwe3-1762152.pdf> Ohmite B20 <https://www.ohmite.com/assets/docs/res_200.pdf?r=false>; DKPN: P20936TR-ND; MANUFACTURER: Panasonic Electronic Components; MOPN: 667-ERJ-PB6B1004V; MPN: ERJ-PB6B1004V; POWER: 0.25W; RESISTANCE: 1M; TOLERANCE: 0.1%; VOLTAGE_CONTINUOUS: 150V; VOLTAGE_MAX: 150V
R35 = HyTechDevices:RESISTOR_?_*: Resistor PWR163 Series <https://www.mouser.com/datasheet/2/54/pwr163-777985.pdf> AC Series <https://www.mouser.com/datasheet/2/447/Yageo_PYu_AC_51_RoHS_L_7_1714230-1874691.pdf> PU Series <https://www.mouser.com/datasheet/2/447/PYu-PU_51_RoHS_L_6-1504619.pdf> UCR Series <https://fscdn.rohm.com/en/products/databook/datasheet/passive/resistor/chip_resistor/ucr-e.pdf> ERA Series <https://www.mouser.com/datasheet/2/315/AOA0000C307-1149632.pdf> PWR263 Series <https://www.mouser.com/datasheet/2/54/pwr263s_35-778069.pdf> KTR Series <https://www.mouser.com/datasheet/2/348/ROHM_S_A0011075115_1-2563276.pdf> RC Series <https://www.mouser.com/datasheet/2/447/Yageo_03_18_2021_PYu_RC_Group_51_RoHS_L_11-2199992.pdf> ERJ Low Resistance Series <https://www.mouser.com/datasheet/2/315/AOA0000C313-1141758.pdf> ERJ PB3, PB6 Series <https://www.mouser.com/datasheet/2/315/AOA0000C328-1530132.pdf> ERJ PA2, P03, PA3, P06, P08, P14 Series <https://www.mouser.com/datasheet/2/315/AOA0000C331-1141874.pdf> B20 Series <https://www.ohmite.com/assets/docs/res_200.pdf?r=false> TE Connectivity/Holsworthy RN73 Series <https://www.mouser.com/datasheet/2/418/4/NG_DS_1773270_M-604713.pdf> Vishay Dale D/CRCW e3 <https://www.mouser.com/datasheet/2/427/dcrcwe3-1762152.pdf> Ohmite B20 <https://www.ohmite.com/assets/docs/res_200.pdf?r=false>; DKPN: P20904TR-ND; MANUFACTURER: Panasonic Electronic Components; MOPN: 667-ERJ-PB6B5233V; MPN: ERJ-PB6B5233V; POWER: 0.25W; RESISTANCE: 523k; TOLERANCE: 0.1%; VOLTAGE_CONTINUOUS: 150V; VOLTAGE_MAX: 150V
R40 = HyTechDevices:RESISTOR_?_*: Resistor PWR163 Series <https://www.mouser.com/datasheet/2/54/pwr163-777985.pdf> AC Series <https://www.mouser.com/datasheet/2/447/Yageo_PYu_AC_51_RoHS_L_7_1714230-1874691.pdf> PU Series <https://www.mouser.com/datasheet/2/447/PYu-PU_51_RoHS_L_6-1504619.pdf> UCR Series <https://fscdn.rohm.com/en/products/databook/datasheet/passive/resistor/chip_resistor/ucr-e.pdf> ERA Series <https://www.mouser.com/datasheet/2/315/AOA0000C307-1149632.pdf> PWR263 Series <https://www.mouser.com/datasheet/2/54/pwr263s_35-778069.pdf> KTR Series <https://www.mouser.com/datasheet/2/348/ROHM_S_A0011075115_1-2563276.pdf> RC Series <https://www.mouser.com/datasheet/2/447/Yageo_03_18_2021_PYu_RC_Group_51_RoHS_L_11-2199992.pdf> ERJ Low Resistance Series <https://www.mouser.com/datasheet/2/315/AOA0000C313-1141758.pdf> ERJ PB3, PB6 Series <https://www.mouser.com/datasheet/2/315/AOA0000C328-1530132.pdf> ERJ PA2, P03, PA3, P06, P08, P14 Series <https://www.mouser.com/datasheet/2/315/AOA0000C331-1141874.pdf> B20 Series <https://www.ohmite.com/assets/docs/res_200.pdf?r=false> TE Connectivity/Holsworthy RN73 Series <https://www.mouser.com/datasheet/2/418/4/NG_DS_1773270_M-604713.pdf> Vishay Dale D/CRCW e3 <https://www.mouser.com/datasheet/2/427/dcrcwe3-1762152.pdf> Ohmite B20 <https://www.ohmite.com/assets/docs/res_200.pdf?r=false>; DKPN: P22.1KDBCT-ND; MANUFACTURER: Panasonic Electronic Components; MOPN: 667-ERA-3AEB2212V; MPN: ERA-3AEB2212V; POWER: 0.1W; RESISTANCE: 22.1k; TOLERANCE: 0.1%; VOLTAGE_CONTINUOUS: 47.01V; VOLTAGE_MAX: 75V
R41 = HyTechDevices:RESISTOR_?_*: Resistor PWR163 Series <https://www.mouser.com/datasheet/2/54/pwr163-777985.pdf> AC Series <https://www.mouser.com/datasheet/2/447/Yageo_PYu_AC_51_RoHS_L_7_1714230-1874691.pdf> PU Series <https://www.mouser.com/datasheet/2/447/PYu-PU_51_RoHS_L_6-1504619.pdf> UCR Series <https://fscdn.rohm.com/en/products/databook/datasheet/passive/resistor/chip_resistor/ucr-e.pdf> ERA Series <https://www.mouser.com/datasheet/2/315/AOA0000C307-1149632.pdf> PWR263 Series <https://www.mouser.com/datasheet/2/54/pwr263s_35-778069.pdf> KTR Series <https://www.mouser.com/datasheet/2/348/ROHM_S_A0011075115_1-2563276.pdf> RC Series <https://www.mouser.com/datasheet/2/447/Yageo_03_18_2021_PYu_RC_Group_51_RoHS_L_11-2199992.pdf> ERJ Low Resistance Series <https://www.mouser.com/datasheet/2/315/AOA0000C313-1141758.pdf> ERJ PB3, PB6 Series <https://www.mouser.com/datasheet/2/315/AOA0000C328-1530132.pdf> ERJ PA2, P03, PA3, P06, P08, P14 Series <https://www.mouser.com/datasheet/2/315/AOA0000C331-1141874.pdf> B20 Series <https://www.ohmite.com/assets/docs/res_200.pdf?r=false> TE Connectivity/Holsworthy RN73 Series <https://www.mouser.com/datasheet/2/418/4/NG_DS_1773270_M-604713.pdf> Vishay Dale D/CRCW e3 <https://www.mouser.com/datasheet/2/427/dcrcwe3-1762152.pdf> Ohmite B20 <https://www.ohmite.com/assets/docs/res_200.pdf?r=false>; DKPN: RHM330KAHTR-ND; MANUFACTURER: Rohm Semiconductor; MOPN: 755-KTR10EZPF3303; MPN: KTR10EZPF3303; POWER: 0.125W; RESISTANCE: 330k; TOLERANCE: 1%; VOLTAGE_CONTINUOUS: 203.1V; VOLTAGE_MAX: 400V
R45 R46 R52 R53 R57 R58 = HyTechDevices:RESISTOR_?_*: Resistor PWR163 Series <https://www.mouser.com/datasheet/2/54/pwr163-777985.pdf> AC Series <https://www.mouser.com/datasheet/2/447/Yageo_PYu_AC_51_RoHS_L_7_1714230-1874691.pdf> PU Series <https://www.mouser.com/datasheet/2/447/PYu-PU_51_RoHS_L_6-1504619.pdf> UCR Series <https://fscdn.rohm.com/en/products/databook/datasheet/passive/resistor/chip_resistor/ucr-e.pdf> ERA Series <https://www.mouser.com/datasheet/2/315/AOA0000C307-1149632.pdf> PWR263 Series <https://www.mouser.com/datasheet/2/54/pwr263s_35-778069.pdf> KTR Series <https://www.mouser.com/datasheet/2/348/ROHM_S_A0011075115_1-2563276.pdf> RC Series <https://www.mouser.com/datasheet/2/447/Yageo_03_18_2021_PYu_RC_Group_51_RoHS_L_11-2199992.pdf> ERJ Low Resistance Series <https://www.mouser.com/datasheet/2/315/AOA0000C313-1141758.pdf> ERJ PB3, PB6 Series <https://www.mouser.com/datasheet/2/315/AOA0000C328-1530132.pdf> ERJ PA2, P03, PA3, P06, P08, P14 Series <https://www.mouser.com/datasheet/2/315/AOA0000C331-1141874.pdf> B20 Series <https://www.ohmite.com/assets/docs/res_200.pdf?r=false> TE Connectivity/Holsworthy RN73 Series <https://www.mouser.com/datasheet/2/418/4/NG_DS_1773270_M-604713.pdf> Vishay Dale D/CRCW e3 <https://www.mouser.com/datasheet/2/427/dcrcwe3-1762152.pdf> Ohmite B20 <https://www.ohmite.com/assets/docs/res_200.pdf?r=false>; DKPN: RHM365KAHTR-ND; MANUFACTURER: Rohm; MOPN: 755-KTR10EZPF3653; MPN: KTR10EZPF3653; POWER: 0.125W; RESISTANCE: 365k; TOLERANCE: 1%; VOLTAGE_CONTINUOUS: 213V; VOLTAGE_MAX: 350V
R47 R48 = HyTechDevices:RESISTOR_?_*: Resistor PWR163 Series <https://www.mouser.com/datasheet/2/54/pwr163-777985.pdf> AC Series <https://www.mouser.com/datasheet/2/447/Yageo_PYu_AC_51_RoHS_L_7_1714230-1874691.pdf> PU Series <https://www.mouser.com/datasheet/2/447/PYu-PU_51_RoHS_L_6-1504619.pdf> UCR Series <https://fscdn.rohm.com/en/products/databook/datasheet/passive/resistor/chip_resistor/ucr-e.pdf> ERA Series <https://www.mouser.com/datasheet/2/315/AOA0000C307-1149632.pdf> PWR263 Series <https://www.mouser.com/datasheet/2/54/pwr263s_35-778069.pdf> KTR Series <https://www.mouser.com/datasheet/2/348/ROHM_S_A0011075115_1-2563276.pdf> RC Series <https://www.mouser.com/datasheet/2/447/Yageo_03_18_2021_PYu_RC_Group_51_RoHS_L_11-2199992.pdf> ERJ Low Resistance Series <https://www.mouser.com/datasheet/2/315/AOA0000C313-1141758.pdf> ERJ PB3, PB6 Series <https://www.mouser.com/datasheet/2/315/AOA0000C328-1530132.pdf> ERJ PA2, P03, PA3, P06, P08, P14 Series <https://www.mouser.com/datasheet/2/315/AOA0000C331-1141874.pdf> B20 Series <https://www.ohmite.com/assets/docs/res_200.pdf?r=false> TE Connectivity/Holsworthy RN73 Series <https://www.mouser.com/datasheet/2/418/4/NG_DS_1773270_M-604713.pdf> Vishay Dale D/CRCW e3 <https://www.mouser.com/datasheet/2/427/dcrcwe3-1762152.pdf> Ohmite B20 <https://www.ohmite.com/assets/docs/res_200.pdf?r=false>; DKPN: RHM46.4KAICT-ND; MANUFACTURER: Rohm Semiconductor; MOPN: 755-KTR18EZPF4642; MPN: KTR18EZPF4642; POWER: 0.25W; RESISTANCE: 46.4k; TOLERANCE: 1%; VOLTAGE_CONTINUOUS: 107.7V; VOLTAGE_MAX: 500V
R49 = HyTechDevices:RESISTOR_?_*: Resistor PWR163 Series <https://www.mouser.com/datasheet/2/54/pwr163-777985.pdf> AC Series <https://www.mouser.com/datasheet/2/447/Yageo_PYu_AC_51_RoHS_L_7_1714230-1874691.pdf> PU Series <https://www.mouser.com/datasheet/2/447/PYu-PU_51_RoHS_L_6-1504619.pdf> UCR Series <https://fscdn.rohm.com/en/products/databook/datasheet/passive/resistor/chip_resistor/ucr-e.pdf> ERA Series <https://www.mouser.com/datasheet/2/315/AOA0000C307-1149632.pdf> PWR263 Series <https://www.mouser.com/datasheet/2/54/pwr263s_35-778069.pdf> KTR Series <https://www.mouser.com/datasheet/2/348/ROHM_S_A0011075115_1-2563276.pdf> RC Series <https://www.mouser.com/datasheet/2/447/Yageo_03_18_2021_PYu_RC_Group_51_RoHS_L_11-2199992.pdf> ERJ Low Resistance Series <https://www.mouser.com/datasheet/2/315/AOA0000C313-1141758.pdf> ERJ PB3, PB6 Series <https://www.mouser.com/datasheet/2/315/AOA0000C328-1530132.pdf> ERJ PA2, P03, PA3, P06, P08, P14 Series <https://www.mouser.com/datasheet/2/315/AOA0000C331-1141874.pdf> B20 Series <https://www.ohmite.com/assets/docs/res_200.pdf?r=false> TE Connectivity/Holsworthy RN73 Series <https://www.mouser.com/datasheet/2/418/4/NG_DS_1773270_M-604713.pdf> Vishay Dale D/CRCW e3 <https://www.mouser.com/datasheet/2/427/dcrcwe3-1762152.pdf> Ohmite B20 <https://www.ohmite.com/assets/docs/res_200.pdf?r=false>; DKPN: P5.9KDBCT-ND; MANUFACTURER: Panasonic Electronic Components; MOPN: 667-ERA-3AEB5901V; MPN: ERA-3AEB5901V; POWER: 0.1W; RESISTANCE: 5.9k; TOLERANCE: 0.1%; VOLTAGE_CONTINUOUS: 24.29V; VOLTAGE_MAX: 75V
R51 = HyTechDevices:RESISTOR_?_*: Resistor PWR163 Series <https://www.mouser.com/datasheet/2/54/pwr163-777985.pdf> AC Series <https://www.mouser.com/datasheet/2/447/Yageo_PYu_AC_51_RoHS_L_7_1714230-1874691.pdf> PU Series <https://www.mouser.com/datasheet/2/447/PYu-PU_51_RoHS_L_6-1504619.pdf> UCR Series <https://fscdn.rohm.com/en/products/databook/datasheet/passive/resistor/chip_resistor/ucr-e.pdf> ERA Series <https://www.mouser.com/datasheet/2/315/AOA0000C307-1149632.pdf> PWR263 Series <https://www.mouser.com/datasheet/2/54/pwr263s_35-778069.pdf> KTR Series <https://www.mouser.com/datasheet/2/348/ROHM_S_A0011075115_1-2563276.pdf> RC Series <https://www.mouser.com/datasheet/2/447/Yageo_03_18_2021_PYu_RC_Group_51_RoHS_L_11-2199992.pdf> ERJ Low Resistance Series <https://www.mouser.com/datasheet/2/315/AOA0000C313-1141758.pdf> ERJ PB3, PB6 Series <https://www.mouser.com/datasheet/2/315/AOA0000C328-1530132.pdf> ERJ PA2, P03, PA3, P06, P08, P14 Series <https://www.mouser.com/datasheet/2/315/AOA0000C331-1141874.pdf> B20 Series <https://www.ohmite.com/assets/docs/res_200.pdf?r=false> TE Connectivity/Holsworthy RN73 Series <https://www.mouser.com/datasheet/2/418/4/NG_DS_1773270_M-604713.pdf> Vishay Dale D/CRCW e3 <https://www.mouser.com/datasheet/2/427/dcrcwe3-1762152.pdf> Ohmite B20 <https://www.ohmite.com/assets/docs/res_200.pdf?r=false>; DKPN: RHM1241CT-ND; MANUFACTURER: Rohm Semiconductor; MOPN: 755-UCR03EVPFLR120; MPN: UCR03EVPFLR120; POWER: 0.25W; RESISTANCE: 0.12; TOLERANCE: 1%; VOLTAGE_CONTINUOUS: 0.173V
R54 R59 = HyTechDevices:RESISTOR_?_*: Resistor PWR163 Series <https://www.mouser.com/datasheet/2/54/pwr163-777985.pdf> AC Series <https://www.mouser.com/datasheet/2/447/Yageo_PYu_AC_51_RoHS_L_7_1714230-1874691.pdf> PU Series <https://www.mouser.com/datasheet/2/447/PYu-PU_51_RoHS_L_6-1504619.pdf> UCR Series <https://fscdn.rohm.com/en/products/databook/datasheet/passive/resistor/chip_resistor/ucr-e.pdf> ERA Series <https://www.mouser.com/datasheet/2/315/AOA0000C307-1149632.pdf> PWR263 Series <https://www.mouser.com/datasheet/2/54/pwr263s_35-778069.pdf> KTR Series <https://www.mouser.com/datasheet/2/348/ROHM_S_A0011075115_1-2563276.pdf> RC Series <https://www.mouser.com/datasheet/2/447/Yageo_03_18_2021_PYu_RC_Group_51_RoHS_L_11-2199992.pdf> ERJ Low Resistance Series <https://www.mouser.com/datasheet/2/315/AOA0000C313-1141758.pdf> ERJ PB3, PB6 Series <https://www.mouser.com/datasheet/2/315/AOA0000C328-1530132.pdf> ERJ PA2, P03, PA3, P06, P08, P14 Series <https://www.mouser.com/datasheet/2/315/AOA0000C331-1141874.pdf> B20 Series <https://www.ohmite.com/assets/docs/res_200.pdf?r=false> TE Connectivity/Holsworthy RN73 Series <https://www.mouser.com/datasheet/2/418/4/NG_DS_1773270_M-604713.pdf> Vishay Dale D/CRCW e3 <https://www.mouser.com/datasheet/2/427/dcrcwe3-1762152.pdf> Ohmite B20 <https://www.ohmite.com/assets/docs/res_200.pdf?r=false>; DKPN: RHM1.00MAHTR-ND; MANUFACTURER: Rohm Semiconductor; MOPN: 755-KTR10EZPF1004; MPN: KTR10EZPF1004; POWER: 0.125W; RESISTANCE: 1M; TOLERANCE: 1%; VOLTAGE_CONTINUOUS: 353.5V; VOLTAGE_MAX: 400V
R55 R60 = HyTechDevices:RESISTOR_?_*: Resistor PWR163 Series <https://www.mouser.com/datasheet/2/54/pwr163-777985.pdf> AC Series <https://www.mouser.com/datasheet/2/447/Yageo_PYu_AC_51_RoHS_L_7_1714230-1874691.pdf> PU Series <https://www.mouser.com/datasheet/2/447/PYu-PU_51_RoHS_L_6-1504619.pdf> UCR Series <https://fscdn.rohm.com/en/products/databook/datasheet/passive/resistor/chip_resistor/ucr-e.pdf> ERA Series <https://www.mouser.com/datasheet/2/315/AOA0000C307-1149632.pdf> PWR263 Series <https://www.mouser.com/datasheet/2/54/pwr263s_35-778069.pdf> KTR Series <https://www.mouser.com/datasheet/2/348/ROHM_S_A0011075115_1-2563276.pdf> RC Series <https://www.mouser.com/datasheet/2/447/Yageo_03_18_2021_PYu_RC_Group_51_RoHS_L_11-2199992.pdf> ERJ Low Resistance Series <https://www.mouser.com/datasheet/2/315/AOA0000C313-1141758.pdf> ERJ PB3, PB6 Series <https://www.mouser.com/datasheet/2/315/AOA0000C328-1530132.pdf> ERJ PA2, P03, PA3, P06, P08, P14 Series <https://www.mouser.com/datasheet/2/315/AOA0000C331-1141874.pdf> B20 Series <https://www.ohmite.com/assets/docs/res_200.pdf?r=false> TE Connectivity/Holsworthy RN73 Series <https://www.mouser.com/datasheet/2/418/4/NG_DS_1773270_M-604713.pdf> Vishay Dale D/CRCW e3 <https://www.mouser.com/datasheet/2/427/dcrcwe3-1762152.pdf> Ohmite B20 <https://www.ohmite.com/assets/docs/res_200.pdf?r=false>; DKPN: RHM3.3KAYTR-ND; MANUFACTURER: Rohm; MOPN: 755-KTR03EZPF3301; MPN: KTR03EZPF3301; POWER: 0.1W; RESISTANCE: 3.3k; TOLERANCE: 1%; VOLTAGE_CONTINUOUS: 18.17V; VOLTAGE_MAX: 350V
R56 R61 = HyTechDevices:RESISTOR_?_*: Resistor PWR163 Series <https://www.mouser.com/datasheet/2/54/pwr163-777985.pdf> AC Series <https://www.mouser.com/datasheet/2/447/Yageo_PYu_AC_51_RoHS_L_7_1714230-1874691.pdf> PU Series <https://www.mouser.com/datasheet/2/447/PYu-PU_51_RoHS_L_6-1504619.pdf> UCR Series <https://fscdn.rohm.com/en/products/databook/datasheet/passive/resistor/chip_resistor/ucr-e.pdf> ERA Series <https://www.mouser.com/datasheet/2/315/AOA0000C307-1149632.pdf> PWR263 Series <https://www.mouser.com/datasheet/2/54/pwr263s_35-778069.pdf> KTR Series <https://www.mouser.com/datasheet/2/348/ROHM_S_A0011075115_1-2563276.pdf> RC Series <https://www.mouser.com/datasheet/2/447/Yageo_03_18_2021_PYu_RC_Group_51_RoHS_L_11-2199992.pdf> ERJ Low Resistance Series <https://www.mouser.com/datasheet/2/315/AOA0000C313-1141758.pdf> ERJ PB3, PB6 Series <https://www.mouser.com/datasheet/2/315/AOA0000C328-1530132.pdf> ERJ PA2, P03, PA3, P06, P08, P14 Series <https://www.mouser.com/datasheet/2/315/AOA0000C331-1141874.pdf> B20 Series <https://www.ohmite.com/assets/docs/res_200.pdf?r=false> TE Connectivity/Holsworthy RN73 Series <https://www.mouser.com/datasheet/2/418/4/NG_DS_1773270_M-604713.pdf> Vishay Dale D/CRCW e3 <https://www.mouser.com/datasheet/2/427/dcrcwe3-1762152.pdf> Ohmite B20 <https://www.ohmite.com/assets/docs/res_200.pdf?r=false>; DKPN: RHM4.99KAICT-ND; MANUFACTURER: Rohm Semiconductor; MOPN: 755-KTR18EZPF4991; MPN: KTR18EZPF4991; POWER: 0.25W; RESISTANCE: 4.99k; TOLERANCE: 1%; VOLTAGE_CONTINUOUS: 35.32V; VOLTAGE_MAX: 500V
TS+ = HyTechDevices:CONNECTOR-5_?_*; MANUFACTURER: Molex; MPN: 43650-0717
TS- = HyTechDevices:CONNECTOR-5_?_*; MANUFACTURER: Molex; MPN: 43650-0617
U5 = HyTechDevices:RELAY_SOLIDSTATE_NO_*: AQY214EHA Normally Open Solid State Relay Datasheet <https://www.datasheetq.com/datasheet-download/287654/1/Panasonic/AQY214EH> Crydom CMX Series Solid State Normally Open Relay Datasheet <https://www.mouser.com/datasheet/2/657/cmx_series_dc_pcb_mount-1370813.pdf> AB38S-Q Datasheet <https://comus-intl.com/wp-content/uploads/2016/09/AB38S-Q.pdf> CPC1020NTR Datasheet <https://www.mouser.com/datasheet/2/240/CPC1020N-1546163.pdf>; DKPN: 1835-1216-ND; MANUFACTURER: Comus International; MPN: AB38S-Q; VOLTAGE: 600V
U6 = HyTechDevices:LT8315: LT8315 560VIN Micropower No-Opto Isolated Flyback Converter with 630V/300mA Switch Datasheet <https://www.analog.com/media/en/technical-documentation/data-sheets/8315fa.pdf>; DKPN: 505-LT8315HFE#PBF-ND; MANUFACTURER: Analog Devices Inc.; MOPN: 584-LT8315HFEPBF; MPN: LT8315HFE#PBF
U7 U8 = HyTechDevices:AMC3330*: AMC3330 ±1-V input, precision voltage sensing reinforced isolated amplifier with integrated DC/DC Datasheet <https://www.ti.com/lit/gpn/amc3330>; DKPN: 296-AMC3330DWERCT-ND; MANUFACTURER: Texas Instruments; MOPN: 595-AMC3330DWER; MPN: AMC3330DWER
U10 = HyTechDevices:LTC6994-*: Analog Devices Inc Delay IC 1us to 33.6s Datasheet <https://www.mouser.com/datasheet/2/609/LTC6994_1_6994_2-1270043.pdf>; DKPN: 505-LTC6994CS6-2#TRMPBFCT-ND; MANUFACTURER: Analog Devices Inc; MOPN: 584-C6994HS6-2TRMPBF; MPN: LTC6994HS6-2#TRMPBF

## Board
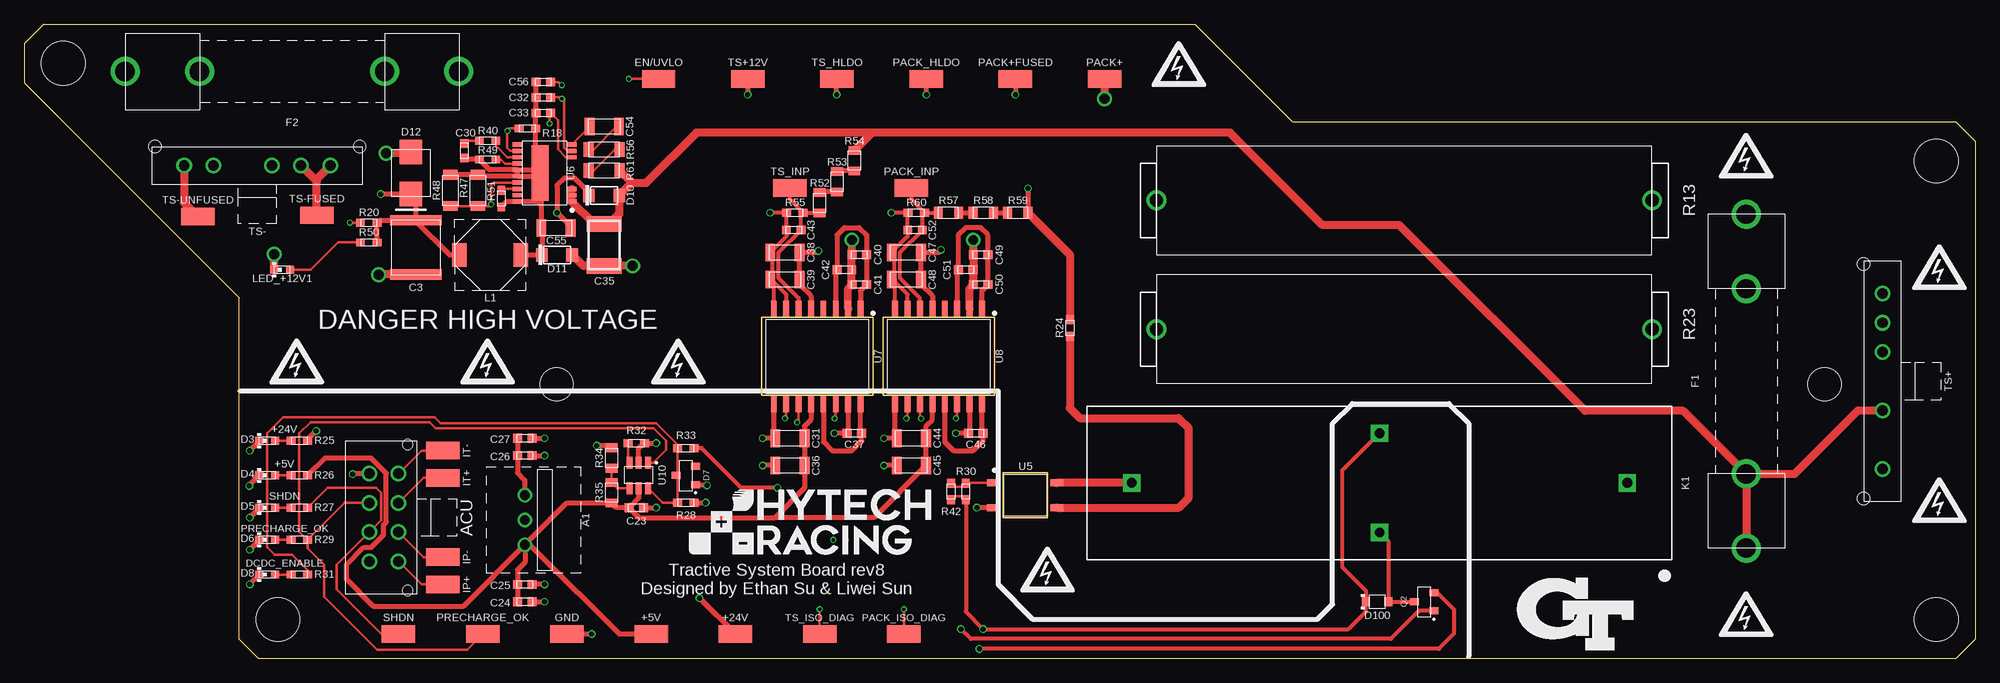
[diagram p3: board, top side]
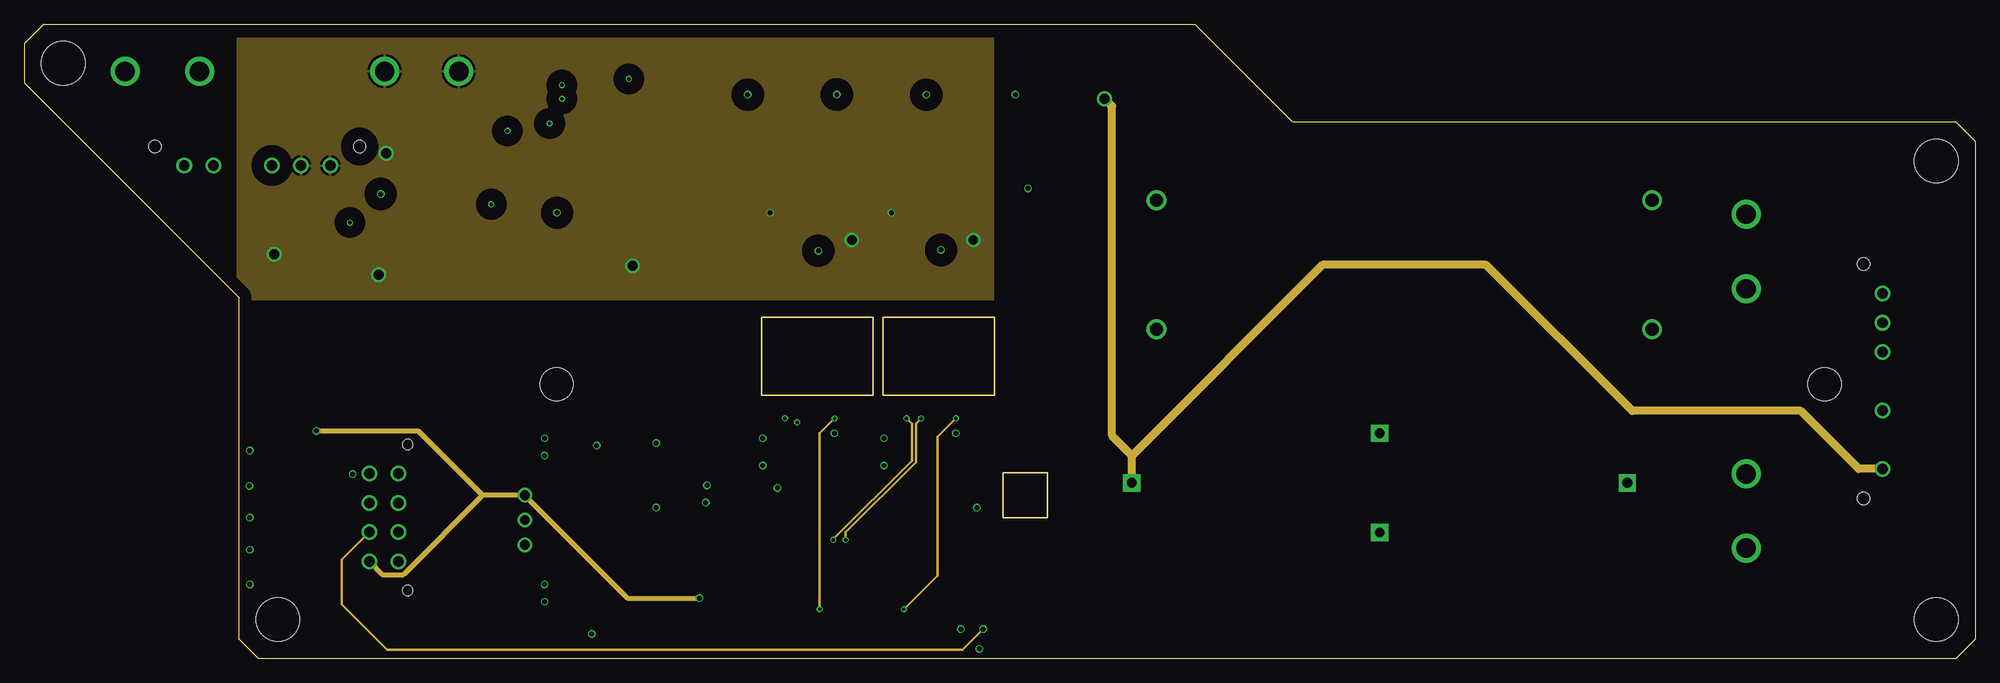
[diagram p4: board, inner layer Route2]
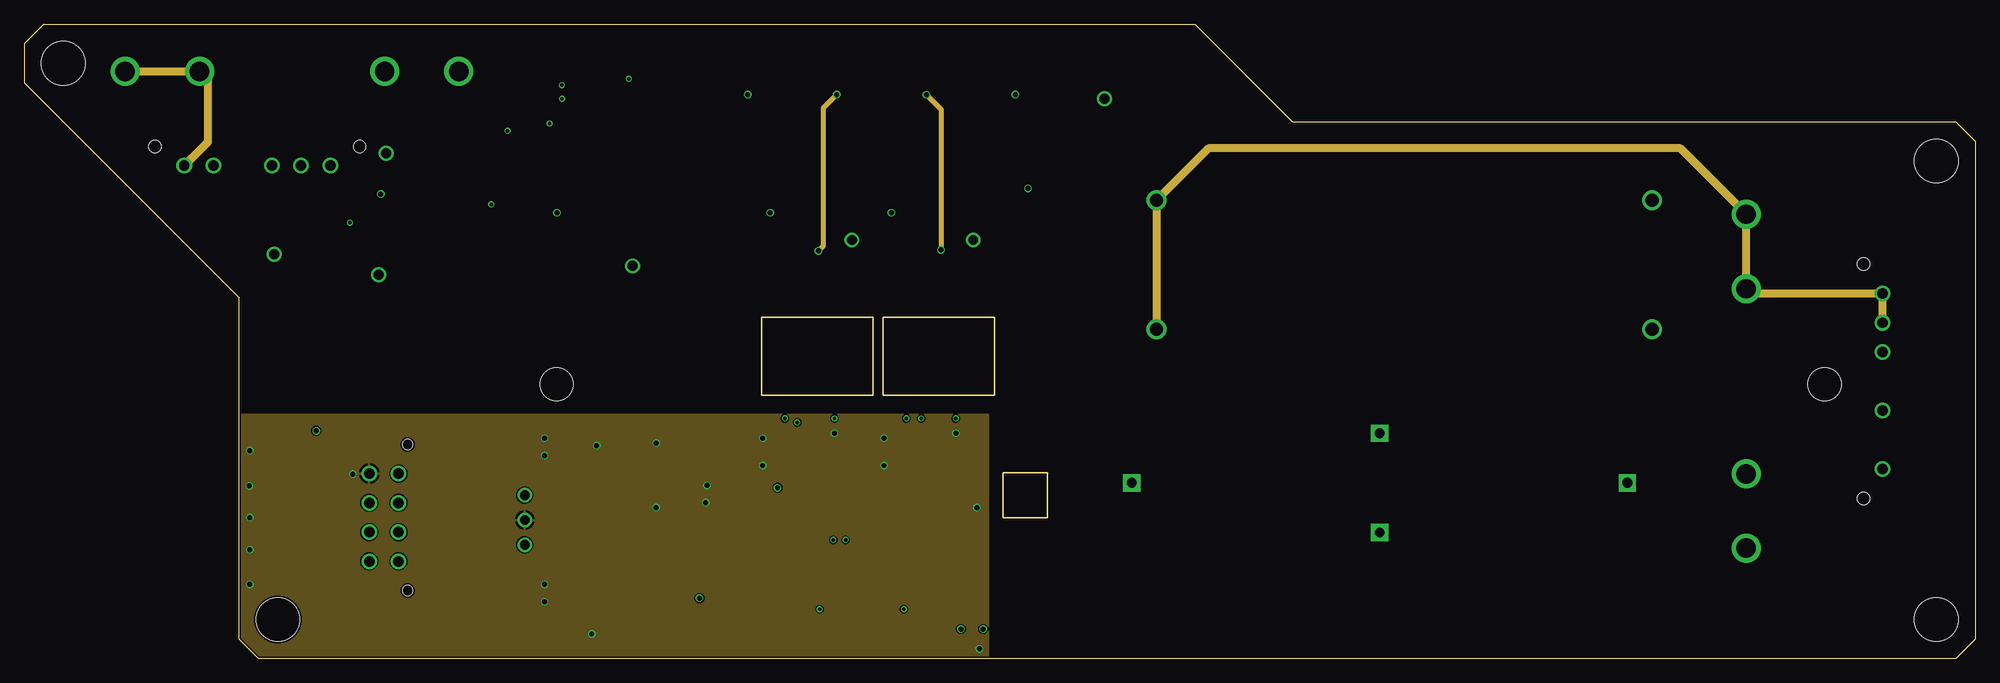
[diagram p5: board, inner layer Route15]
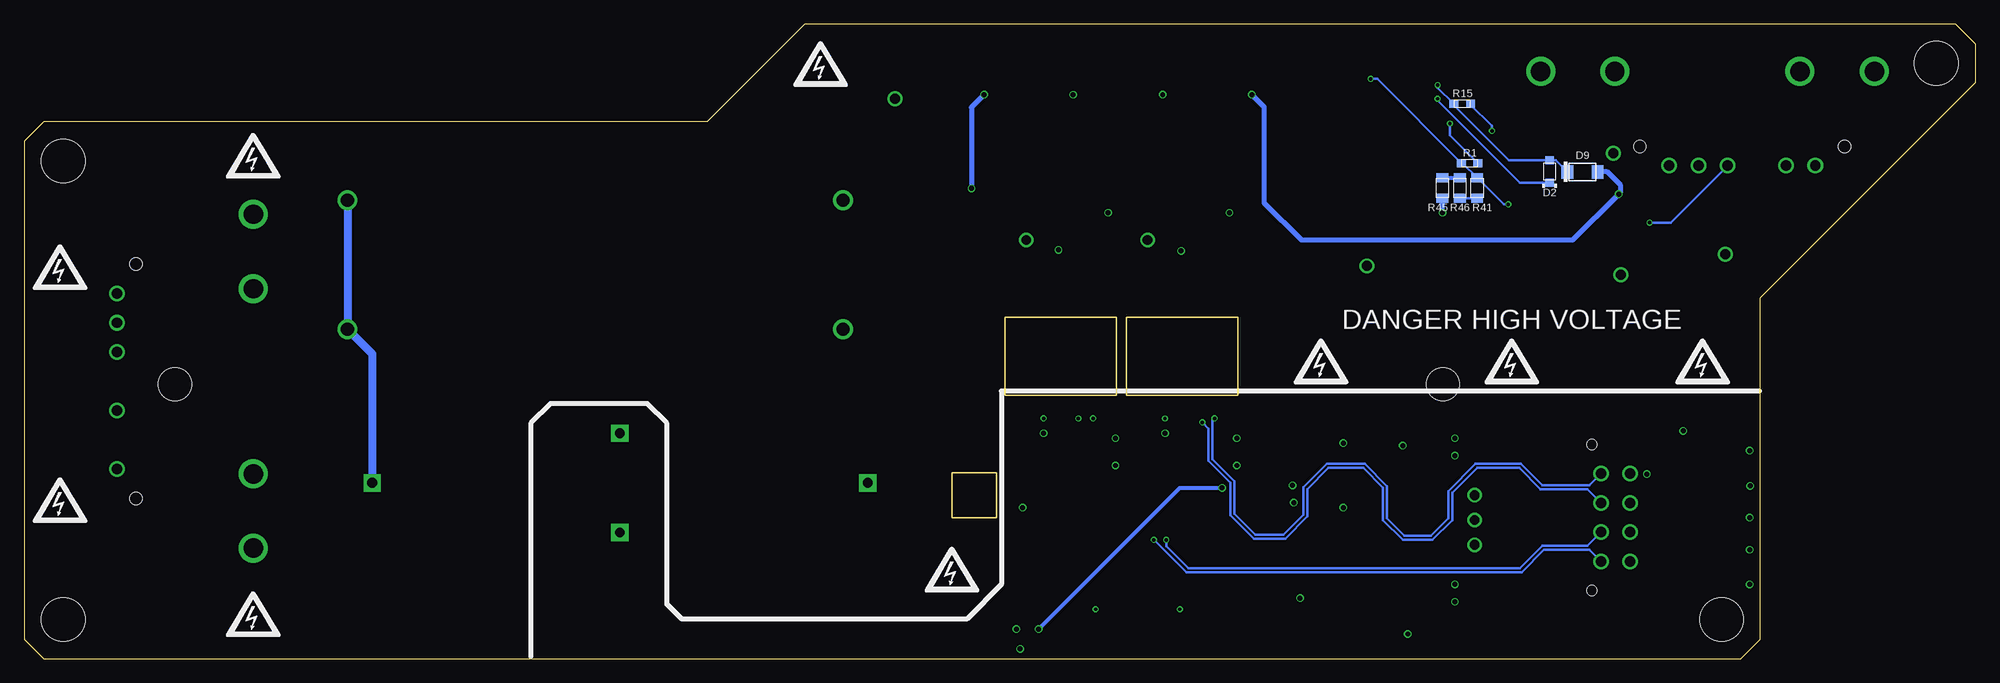
[diagram p6: board, bottom side, seen from below]

Size 200 x 65 mm. Coordinates in mm from the lower left corner, seen from the top.
Outline: 2,65 120,65 130,55 198,55 200,53 200,2 198,0 24,0 22,2 22,37 0,59 0,63 2,65
Copper layers (1+2*15+16): Top 0.035mm / dielectric 0.2mm / Route2 0.0175mm / dielectric 1.065mm / Route15 0.0175mm / dielectric 0.2mm / Bottom 0.035mm
Design rules "JLCPCB (4 Layer)": minimum track width 5mil, minimum drill 0.2mm, track to track 5mil, track to pad 5mil, pad to pad 5mil, via to via 20mil, smd to smd 5mil, copper to edge 0.2mm, drill to drill 21mil, minimum pad ring 6mil, minimum via ring 5mil, stop-mask expansion 2mil, vias tented up to drill 30mil, thermal gap 10mil

### Footprints (pad centres in the part's own frame; a part is rotated, then mirrored left to right if it is on the bottom)
5015 = smd 3.429 x 1.778: 1 0,0
OKI-78SR = drill 0.991: 1 -2.54,0; 2 0,0; 3 2.54,0
MOLEX_MICROFIT_PTH_VERTICAL_08_DUAL = drill 1.067: 1 4.496,-2.997; 2 1.499,-2.997; 3 -1.499,-2.997; 4 -4.496,-2.997; 5 4.496,0; 6 1.499,0; 7 -1.499,0; 8 -4.496,0 | hole 1.067: 7.493,0.94; -7.493,0.94
2220-CAP = smd 1.05 x 5.3: 1 -2.775,0; 2 2.775,0
0603-CAP = smd 0.9 x 0.9: 1 -0.75,0; 2 0.75,0
1206-CAP = smd 1 x 1.8: 1 -1.5,0; 2 1.5,0
1812-CAP = smd 1.6 x 3.6: 1 -2.15,0; 2 2.15,0
SOD-323 = smd 0.8 x 0.9: A -1.15,0; C 1.15,0
0603-LED = smd 0.8 x 0.8: 1 -0.825,0; 2 0.825,0
SOT-23 = smd 0.711 x 0.889: 1 -0.94,-1.003; 2 0.94,-1.003; 3 0,1.003
SOD-123FA = smd 1.2 x 1.4: A -1.55,0; C 1.55,0
SMB(DO-214AA) = smd 2.5 x 2.3: A -2.15,0; C 2.15,0
122 = drill 1.981: 1 -17.107,0; 2 -9.474,0; 3 9.5,0; 4 17.107,0
D = drill 1 pad 1.778 square: 1 -25.4,0; 2 25.4,0; 3 0,5.08; 4 0,-5.08
SRR0745A-102M = smd 1.5 x 2.4: 1 -3.15,0; 2 3.15,0
0603-RES = smd 0.9 x 0.8: 1 -0.85,0; 2 0.85,0
B20-SHORTENED = drill 1.35: 1 25.4,0; 2 -25.4,0
0805-RES = smd 0.9 x 1.2: 1 -1.05,0; 2 1.05,0
1206-RES = smd 1 x 1.5: 1 -1.6,0; 2 1.6,0
MOLEX_MICROFIT_PTH_VERTICAL_07_SINGLE_SPACED = drill 1.067: 1 -8.992,0; 2 -5.994,0; 3 -2.997,0; 4 2.997,0; 5 8.992,0 | hole 1.27: 12.002,-1.956; -12.002,-1.956
MOLEX_MICROFIT_PTH_VERTICAL_06_SINGLE_SPACED = drill 1.067: 1 -7.493,0; 2 -4.496,0; 3 -1.499,0; 4 4.496,0; 5 7.493,0 | hole 1.27: 10.503,-1.956; -10.503,-1.956
SOP-04-AIRGAP = smd 0.7 x 1.3: 1 -1.27,-3.25; 2 1.27,-3.25; 3 1.27,3.25; 4 -1.27,3.25
TSSOP-20(16) = smd 0.45 x 1.05: 1 -2.925,-2.775; 2 -2.275,-2.775; 3 -1.625,-2.775; 8 1.625,-2.775; 9 2.275,-2.775; 10 2.925,-2.775; 11 2.925,2.775; 12 2.275,2.775; 13 1.625,2.775; 14 0.975,2.775; 15 0.325,2.775; 16 -0.325,2.775; 17 -0.975,2.775; 18 -1.625,2.775; 19 -2.275,2.775; 20 -2.925,2.775 | smd 5.68 x 1.78: THERMAL 0,0.47
SOIC-16W-AIRGAP = smd 0.6 x 1.65: 1 -4.445,-4.875; 2 -3.175,-4.875; 3 -1.905,-4.875; 4 -0.635,-4.875; 5 0.635,-4.875; 6 1.905,-4.875; 7 3.175,-4.875; 8 4.445,-4.875; 9 4.445,4.875; 10 3.175,4.875; 11 1.905,4.875; 12 0.635,4.875; 13 -0.635,4.875; 14 -1.905,4.875; 15 -3.175,4.875; 16 -4.445,4.875
SOT-23-6 = smd 0.62 x 1.22: 1 -0.95,-1.31; 2 0,-1.31; 3 0.95,-1.31; 4 -0.95,1.31; 5 0,1.31; 6 0.95,1.31
MOUNTING_M4 = hole 4.5: 0,0
MOUNTING_M3 = hole 3.4: 0,0

### Placement (x,y rotation side)
$$U$1  [HV_MEDIUM]  67.06,30.46 0 top
$$U$4  [HV_MEDIUM]  118.36,60.94 0 top
$$U$6  [HV_MEDIUM]  196.34,40.11 0 top
$$U$8  [HV_MEDIUM]  27.94,30.46 0 top
$$U$104  [HV_MEDIUM]  27.94,30.46 0 bottom
$$U$105  [HV_MEDIUM]  196.34,40.11 0 bottom
$$U$106  [HV_MEDIUM]  118.36,60.94 0 bottom
$$U$107  [HV_MEDIUM]  67.06,30.46 0 bottom
+5V  64.26,2.52 0 top
+24V  72.9,2.52 0 top
A1  51.31,14.2 270 top
ACU  38.35,14.45 270 top
C3  40.13,42.14 270 top
C23  62.74,15.47 0 top
C24  51.31,5.82 0 top
C25  51.31,7.6 0 top
C26  51.31,20.8 0 top
C27  51.31,22.58 0 top
C30  45.12,52.05 270 top
C31  78.49,22.58 180 top
C32  53.21,57.51 180 top
C33  53.21,55.93 180 top
C35  59.44,42.39 270 top
C36  78.49,19.79 180 top
C37  85.09,23.09 180 top
C38  77.98,41.63 180 top
C39  77.98,38.84 180 top
C40  85.6,41.38 180 top
C41  85.6,38.33 180 top
C42  84.07,39.85 180 top
C43  78.87,43.92 180 top
C44  90.93,22.58 180 top
C45  90.93,19.79 180 top
C46  97.54,23.09 180 top
C47  90.42,41.63 180 top
C48  90.42,38.84 180 top
C49  98.04,41.38 180 top
C50  98.04,38.33 180 top
C51  96.52,39.85 180 top
C52  91.31,43.92 180 top
C54  59.46,54.54 180 top
C55  54.51,44.13 180 top
C56  53.21,59.09 180 top
D2  43.63,49.92 270 bottom
D3  24.89,22.33 0 top
D4  24.89,18.77 0 top
D5  24.89,15.47 0 top
D6  24.89,12.17 0 top
D7  67.82,18.77 90 top
D8  24.89,8.61 0 top
D9  40.26,49.89 180 bottom
D10  59.44,47.47 180 top
D11  54.61,41.38 180 top
D12  39.62,49.76 270 top
D100  138.68,5.82 180 top
EN/UVLO  65.02,59.41 0 top
F1  176.53,28.42 270 top
F2  27.43,60.17 0 top
GND  55.63,2.52 0 top
IP+  42.93,7.6 0 top
IP-  42.93,10.39 0 top
IT+  42.93,18.52 0 top
IT-  42.93,21.31 0 top
K1  138.94,18.01 180 top
L1  47.75,41.38 0 top
LED_+12V1  26.42,39.85 0 top
PACK+  110.74,59.41 0 top
PACK+FUSED  101.6,59.41 0 top
PACK_HLDO  92.46,59.41 0 top
PACK_INP  90.93,48.24 0 top
PACK_ISO_DIAG  90.17,2.52 0 top
PRECHARGE_OK  46.99,2.52 0 top
Q2  143.51,5.82 90 top
R1  51.82,50.78 180 bottom
R13  141.48,46.97 0 top
R15  52.58,56.87 180 bottom
R18  51.56,54.33 180 top
R20  35.31,44.68 0 top
R23  141.48,33.76 0 top
R24  107.19,33.89 90 top
R25  28.19,22.33 0 top
R26  28.19,18.77 180 top
R27  28.19,15.47 0 top
R28  67.82,15.98 180 top
R29  28.19,12.17 0 top
R30  96.52,17.12 90 top
R31  28.19,8.61 0 top
R32  62.74,22.07 180 top
R33  67.82,21.57 0 top
R34  60.2,20.55 270 top
R35  60.2,16.99 270 top
R40  47.5,53.06 0 top
R41  51.05,48.24 270 bottom
R42  95,17.12 90 top
R45  54.61,48.24 270 bottom
R46  52.83,48.24 90 bottom
R47  46.48,47.98 270 top
R48  43.69,47.98 270 top
R49  47.5,51.16 0 top
R50  35.31,42.65 0 top
R51  48.9,47.14 90 top
R52  81.53,46.71 90 top
R53  83.31,48.87 90 top
R54  85.09,51.03 90 top
R55  78.99,45.7 0 top
R56  59.44,52.17 180 top
R57  94.74,45.7 0 top
R58  98.3,45.7 0 top
R59  101.85,45.7 0 top
R60  91.44,45.7 0 top
R61  59.44,50.01 180 top
SHDN  38.35,2.52 0 top
TS+  190.5,28.42 270 top
TS+12V  74.17,59.41 0 top
TS-  23.88,50.52 180 top
TS-FUSED  29.97,45.44 0 top
TS-UNFUSED  17.78,45.31 0 top
TS_HLDO  83.31,59.41 0 top
TS_INP  78.49,48.24 0 top
TS_ISO_DIAG  81.53,2.52 0 top
U5  102.62,16.74 270 top
U6  53.34,49.76 90 top
U7  81.28,30.96 180 top
U8  93.73,30.96 180 top
U10  62.99,18.77 180 top
U$2  [MOUNTING_M4]  4,61 0 top
U$6  [MOUNTING_M4]  26,4 0 top
U$7  [DANGER_HIGH_VOLTAGE]  47.5,34.77 0 top
U$8  [HV_MEDIUM]  176.53,51.54 0 top
U$9  [HV_MEDIUM]  47.5,30.46 0 top
U$10  [LOGO_HYTECH_MEDIUM]  68.12,10.71 0 top
U$11  [MOUNTING_M3]  184.56,28.1 0 top
U$12  [MOUNTING_M3]  54.56,28.1 0 top
U$13  [HV_MEDIUM]  176.53,4.55 0 top
U$14  [HV_MEDIUM]  104.9,9.12 0 top
U$15  [HV_MEDIUM]  196.34,16.23 0 top
U$16  [HV_MEDIUM]  176.53,51.54 0 bottom
U$17  [MOUNTING_M4]  196,51 0 top
U$18  [LOGO_GT_MEDIUM]  159,4.55 0 top
U$22  [MOUNTING_M4]  196,4 0 top
U$100  [HV_MEDIUM]  196.34,16.23 0 bottom
U$101  [HV_MEDIUM]  104.9,9.12 0 bottom
U$102  [HV_MEDIUM]  176.53,4.55 0 bottom
U$103  [HV_MEDIUM]  47.5,30.46 0 bottom

### Tracks (layer width: path | path; a pad name or v marks a point on that pad's centre or on a via)
+5V
  Top 0.508: U10.5 62.99,16.47 C23.1 | C23.1 60.67,15.47 R35.2 55.59,15.94 A1.3 | U7.12 80.64,24.49 79.99,23.83 C31.1 C36.1 79.99,17.5 76.94,14.45 | A1.3 51.82,11.66 52.58,10.9 52.58,10.89 60.95,2.52 +5V.1 | C24.1 C25.1 50.56,9.12 51.32,9.88 51.32,11.65 A1.3 | U8.12 93.09,24.49 92.46,23.85 92.46,22.61 C44.1 C45.1 87.1,14.45 76.94,14.45 | C23.1 63,14.45 76.94,14.45 | A1.3 44.96,5.31 35.81,5.31 33.02,8.1 33.02,9.63 34.8,11.41 35.56,11.41 36.83,12.68 36.83,13.7 37.11,13.98 37.11,19 35.56,20.55 30.82,20.55 R26.1
+24V  (via drill 0.51)
  Top 0.508: C27.1 C26.1 50.56,19.03 51.31,18.28 A1.1 | R25.2 29.04,22.45 v29.93,23.34 | v69.22,6.2 +24V.1
  Route2 0.508: ACU.1 36.7,8.61 38.86,8.61 46.99,16.74 | v29.93,23.34 40.39,23.34 46.99,16.74 | 46.99,16.74 A1.1 61.85,6.2 v69.22,6.2
AIL+  (via drill 0.35)
  Top 0.254: R20.1 v33.37,44.68
  Bottom 0.254: v33.37,44.68 31.22,44.68 TS-.3
DCDC_ENABLE
  Top 0.254: U10.4 65.43,15.98 R28.2 66.97,18.62 D7.3 66.97,18.92 R33.1 66.97,21.91 64.77,24.11 42.67,24.11 42.04,24.74 26.54,24.74 24.89,23.09 24.89,11.41 25.65,10.64 27.43,10.64 29.04,9.03 R31.2
EN/UVLO  (via drill 0.35)
  Top 0.254: v61.98,59.41 EN/UVLO.1 | R48.2 R47.2 47.69,46.38 v47.87,46.56 47.87,48.6 48.05,48.78 U6.17
  Bottom 0.254: v47.87,46.56 48.33,46.56 R41.1 52.54,50.78 R1.2 61.3,59.41 v61.98,59.41
FB  (via drill 0.35 pad 0.55)
  Top 0.254: R18.2 49.78,54.33 v49.53,54.08 49.51,54.05 49.51,52.33 49.8,52.04 50.56,52.04 U6.12
  Bottom 0.254: v49.53,54.08 49.53,54.59 51.73,56.78 R15.1
GND  (via drill 0.51)
  Top 0.152: 23.05,17.76 v23.05,17.7 | D8.1 24.07,8.55
  Top 0.254: 63.5,22.07 R32.1
  Top 0.406: Q2.2 144.86,6.76 146.56,5.06 146.56,2.52 145.03,0.99 v97.92,0.99
  Top 0.508: D3.1 24.07,22.27 v23.11,21.31 | D6.1 24.07,12.1 v23.11,11.15 | D5.1 24.07,15.41 v23.11,14.45 | D4.1 23.05,17.76 | 24.07,8.55 v23.11,7.6 | C23.2 v64.77,15.47 | R32.1 v64.77,22.07 | U7.9 76.83,22.73 C31.2 v75.69,22.58 | U7.15 84.45,23.2 C37.2 v83.06,23.09 | v53.34,7.6 C25.2 | C24.2 v53.34,5.82 | C26.2 v53.34,20.8 | C27.2 v53.34,22.58 | GND.1 v58.17,2.52 | ACU.4 33.71,18.95 v33.66,18.9 | v88.14,22.58 C44.2 89.28,22.73 U8.9 | C45.2 v88.14,19.79 | v95.5,23.09 C46.2 96.9,23.2 U8.15 | U5.2 v97.66,15.47 | C36.2 v75.69,19.79 | U10.2 62.99,21.57 63.5,22.07 | R28.1 v69.85,15.98 | R34.1 59.98,21.82 v58.67,21.82 | D7.1 69.9,17.83 v69.98,17.76
  pour Route15: 21.89,24.99 98.81,24.99 98.81,-0.01 21.89,-0.01
INTVCC  (via drill 0.35 pad 0.55)
  Top 0.254: U6.8 55.49,51.38 54.7,52.18 54.7,55.19 C33.1 53.85,55.81 v53.85,54.84
  Bottom 0.254: R1.1 53.85,53.66 v53.85,54.84
IP+  (via drill 0.35)
  Top 0.254: U8.11 91.82,24.73 v91.95,24.61 | ACU.5 40.72,7.6 IP+.1
  Route2 0.254: v91.95,24.61 91.4,24.06 91.4,20.13 84.2,12.93 v84.2,12.17 v84.19,12.17
  Bottom 0.254: ACU.5 39.55,11.15 44.2,11.15 46.48,8.87 80.86,8.87 84.18,12.18 v84.19,12.17
IP-  (via drill 0.35)
  Top 0.254: U8.10 90.55,24.74 v90.42,24.61 | ACU.6 40.92,10.39 IP-.1
  Route2 0.254: v90.42,24.61 90.98,24.05 90.98,20.29 82.93,12.23 v82.93,12.17
  Bottom 0.254: v82.93,12.17 82.93,11.53 80.67,9.27 46.65,9.27 44.36,11.56 39.75,11.56 ACU.6
IREG/SS
  Top 0.254: U6.14 49.28,50.73 48.88,51.14 48.37,51.14 R49.2
IT+  (via drill 0.35)
  Top 0.254: U7.11 79.38,24.35 v79.23,24.21 | ACU.7 40.92,18.52 IT+.1
  Bottom 0.254: ACU.7 39.75,17.35 44.55,17.35 46.74,19.53 51.05,19.53 53.59,16.99 53.59,14.2 55.63,12.17 58.67,12.17 60.71,14.2 60.71,17.5 62.74,19.53 66.29,19.53 68.45,17.38 68.45,14.58 70.73,12.3 73.96,12.3 76.33,14.66 76.33,18.01 78.6,20.28 78.6,23.58 v79.23,24.21
IT-  (via drill 0.35)
  Top 0.254: U7.10 78.11,24.74 v77.98,24.61 | ACU.8 40.72,21.31 IT-.1
  Bottom 0.254: ACU.8 39.55,17.76 44.38,17.76 46.57,19.94 51.23,19.94 54,17.17 54,14.37 55.79,12.57 58.51,12.57 60.3,14.37 60.3,17.67 62.57,19.94 66.46,19.94 68.86,17.54 68.86,14.75 70.9,12.71 73.8,12.71 75.92,14.84 75.92,18.18 78.19,20.44 78.19,24.41 v77.98,24.61
N$1
  Bottom 0.254: R46.1 R41.2
N$2
  Top 0.254: R27.1 D5.2
N$3  (via drill 0.51)
  Top 0.406: v96.01,3.02 97.03,2.01 140.12,2.01 142.99,4.88 Q2.1 | v77.22,17.5 73.49,17.5 69.43,21.57 R33.2
  Bottom 0.406: v77.22,17.5 81.53,17.5 v96.01,3.02
N$4
  Bottom 0.406: R45.1 R46.2
N$10
  Top 0.254: R32.2 61.89,20.24 U10.3
N$11
  Top 0.254: U10.6 60.78,17.46 R35.1 R34.2
N$22
  Top 0.254: R29.1 D6.2
N$24
  Top 0.254: R31.1 D8.2
N$25
  Top 0.254: R25.1 D3.2
N$30
  Top 0.254: R26.2 D4.2
N$33
  Top 0.508: U7.16 85.72,23.2 C37.1 85.84,22.32 84.84,21.31 82.8,21.31 81.92,22.2 U7.13
N$34
  Top 0.254: R61.2 58.34,50.01 60.5,52.17 R56.1
N$35
  Top 0.254: R56.2 58.34,52.17 60.71,54.53 C54.1
N$38
  Top 0.254: U6.10 57.96,54.53 C54.2
N$40
  Top 0.406: K1.3 139.83,12.03 D100.A Q2.3
N$43
  Top 0.254: C30.1 45.38,53.06 R40.1
N$44
  Top 0.254: LED_+12V1.2 29.38,39.85 32.17,42.65 R50.1
N$46  (via drill 0.51)
  Top 0.254: D10.C 57.89,47.75
  Top 0.508: 57.89,47.75 56.39,49.25 55.37,49.25 54.61,48.49 v54.61,45.7 56.01,44.3 C55.1
  Bottom 0.508: v54.61,45.7 R45.2
N$49  (via drill 0.35 pad 0.55)
  Top 0.254: U6.9 55.62,52.03 55.31,52.34 55.31,57.19 v55.12,57.38 54.98,57.52 C32.1
  Bottom 0.254: D2.C 46.68,48.77 55.12,57.22 v55.12,57.38
N$50
  Bottom 0.813: R13.1 R23.1 164.34,31.22 K1.1
N$51
  Top 0.508: U7.1 85.72,37.71 C41.1 C40.1 86.35,43.42 85.6,44.17 84.07,44.17 83.3,43.4 83.3,39.88 C42.2 83.19,39.72 U7.3
N$52
  Top 0.508: U8.16 98.17,23.2 C46.1 98.29,22.33 97.27,21.31 95.25,21.31 94.36,22.2 U8.13
N$53
  Top 0.254: U5.1 96.56,18.01 R30.2 96.18,17.63 95.34,17.63 R42.2
N$55  (via drill 0.35 pad 0.55)
  Top 0.254: C56.1 54.79,59.09 v55.1,58.77 v55.11,58.77
  Bottom 0.254: v55.11,58.77 55.11,58.52 53.46,56.87 R15.2 53.43,56.71 47.8,51.07 D2.A 42.99,51.07 D9.C
N$57
  Top 0.813: U5.3 118.36,15.47 119.38,16.49 119.38,23.6 118.33,24.65 108.2,24.65 107.19,25.67 R24.1
N$59
  Top 0.508: R53.1 81.59,47.82 R52.2
N$60
  Top 0.508: R54.1 83.37,49.98 R53.2
N$64
  Top 0.254: 95.75,39.88 C51.2
  Top 0.508: U8.1 98.17,37.71 C50.1 C49.1 98.79,43.42 98.04,44.17 96.52,44.17 95.75,43.4 95.75,39.88 | C51.2 95.63,39.72 U8.3
N$65
  Top 0.508: R57.2 R58.1
N$66
  Top 0.508: R58.2 R59.1
PACK+  (via drill 1.02)
  Top 0.813: K1.2 U5.4 | PACK+.1 v110.74,57.38
  Route2 0.813: TS+.5 188.06,19.43 182.12,25.38 164.85,25.38 149.86,40.36 133.1,40.36 113.54,20.8 | v110.74,57.38 111.51,56.62 111.51,22.84 113.54,20.8 | K1.2 113.54,20.8
PACK+FUSED  (via drill 0.51 pad 0.55)
  Top 0.508: PACK+FUSED.1 v101.6,57.81 | v102.89,48.19 R59.2
  Top 0.813: R59.2 107.19,41.41 R24.2
  Bottom 0.508: v101.6,57.81 102.91,56.5 102.91,48.2 v102.89,48.19
PACK_HLDO_OUT  (via drill 0.51, 0.51 pad 0.55)
  Top 0.508: U8.5 93.09,37.16 91.92,38.33 C48.1 C47.1 93.73,41.63 v93.98,41.89 | PACK_HLDO.1 92.45,57.81 v92.47,57.79
  Route15 0.508: v92.47,57.79 93.98,56.28 v93.98,41.89
PACK_INP
  Top 0.406: U8.6 91.82,36.93 89.79,38.97 89.79,41.64 C52.1 92.06,45.47 R60.2 | R60.2 90.93,47.05 PACK_INP.1 | R60.2 R57.1
PACK_ISO_DIAG  (via drill 0.35)
  Top 0.254: U8.14 95.63,24.74 v95.5,24.61 | v90.17,5.06 PACK_ISO_DIAG.1
  Route2 0.254: v95.5,24.61 93.6,22.71 93.6,8.48 v90.17,5.06
PGND
  Top 0.508: L1.2 D11.C 53.06,44.09 C55.2 53,44.14 53,46.46 | C56.2 C32.2 C33.2 52.41,55.88 R18.1 52.41,50.22 U6.THERMAL | U6.15 47.72,50.09 R49.1 45.25,51.16 C30.2 | U6.16 46.63,49.44 R47.1 R48.1 | U6.16 U6.15 | U6.16 52.55,49.44 U6.THERMAL | 53,46.46 52.61,46.85 50.58,46.85 U6.20 49.44,46.84 R51.1 | U6.15 52.55,50.09 U6.THERMAL | U6.THERMAL 53,49.63 53,46.46
PRECHARGE_OK
  Top 0.254: U10.1 64.45,20.08 65.79,21.42 65.79,22.33 64.52,23.6 42.16,23.6 41.53,24.23 29.34,24.23 28.19,23.09 28.19,13.02 R29.2 | R29.2 29.04,11.32 30.73,9.63 30.73,6.33 36.17,0.89 45.37,0.89 PRECHARGE_OK.1 | ACU.3 32.83,15.95 R29.2
SHDN  (via drill 0.51)
  Top 0.254: R27.2 31.08,17.5 36.07,17.5 36.58,16.99 36.58,14.2 35.36,12.98 ACU.2 35.33,12.95 32,9.63 32,7.09 36.58,2.52 SHDN.1 | R30.1 96.18,16.61 95.34,16.61 R42.1
  Top 0.406: K1.4 135.13,19.28 135.13,9.37 137.53,6.97 D100.C 137.53,4.8 135.76,3.02 v98.3,3.02 96.52,4.8 R30.1
  Route2 0.254: v98.3,3.02 96.16,0.88 37.19,0.88 32.51,5.56 32.51,10.11 ACU.2
SOURCE
  Top 0.254: R51.2 49.04,48.14 U6.18
TS+12V  (via drill 0.51 pad 0.55)
  Top 0.508: C3.1 36.39,44.91 R20.2 R50.2 | C3.1 40.13,44.83 43.59,41.38 L1.1 | C3.1 40.13,47.1 D12.C v36.53,47.61 | TS+12V.1 v74.16,57.8
  Bottom 0.508: D9.A 37.72,49.89 36.32,48.49 36.32,47.82 v36.53,47.61 41.24,42.9 69.09,42.9 72.9,46.71 72.9,56.53 v74.16,57.8
TS+FUSED
  Top 0.813: F1.3 F1.4 | F1.3 170.08,25.38 160.02,25.38 140.97,44.43 133.1,44.43 123.62,53.9 86.91,53.9 | 86.91,53.9 68.91,53.9 63.75,48.74 62.31,48.74 | 62.31,48.74 R61.1 | 62.31,48.74 62.26,48.74 D10.A 60.99,45.59 59.94,44.54 C35.1 58.41,44.54 U6.1 U6.2 U6.3 | TS+.4 188.01,25.43 181.51,18.92 F1.3 | R54.2 86.91,53.9
TS+UNFUSED
  Route15 0.813: R23.2 R13.2 121.41,52.3 169.76,52.3 F1.1 F1.2 177.01,37.42 TS+.1 TS+.2
TS-FUSED  (via drill 0.51, 1.02)
  Top 0.406: C48.2 88.92,39.35 89.18,39.6 89.18,40.87 88.92,41.12 C47.2 90.56,43.27 C52.2 90.56,45.67 | 78.12,45.67 C43.2 78.12,43.27 C38.2 76.48,41.12 76.73,40.87 76.73,39.6 76.48,39.35 C39.2 | R60.1 v88.9,45.7 | R55.1 v76.45,45.7 | C48.2 89.05,38.84 90.55,37.34 U8.7 | U8.8 89.28,38.48 C48.2 | U7.7 78.11,37.34 76.61,38.84 C39.2 | C39.2 76.83,38.48 U7.8
  Top 0.508: 90.56,45.67 R60.1 | 97.29,39.88 C51.1 | 97.27,38.35 C50.2 | C41.2 84.82,38.35 | 84.82,41.35 C40.2 | 78.12,45.67 R55.1
  Top 0.813: C41.2 84.45,37.94 U7.2 | C50.2 96.9,37.94 U8.2 | 97.29,39.88 C49.2 97.29,42.89 v97.28,42.9 | C51.1 97.27,38.35 | 84.82,38.35 C42.1 84.82,41.35 | C40.2 84.84,41.39 v84.84,42.9 | v62.35,40.24 v62.34,40.24 C35.2 57.29,40.24 D11.A | C3.2 36.34,39.36 v36.32,39.35 | LED_+12V1.1 v25.59,41.45 v25.6,41.45 | TS-FUSED.1 29.97,48.92 | 29.97,48.92 TS-.2 | 29.97,48.92 29.97,49.12 TS-.1 | D12.A 39.51,51.79 v37.08,51.79
  pour Route2 (isolate 1.27): 21.84,63.98 21.84,36.81 99.31,36.81 99.31,63.98
TS-UNFUSED
  Top 0.813: TS-.5 16.38,46.71 TS-UNFUSED.1
  Route15 0.813: F2.1 F2.2 18.8,59.34 18.8,52.94 TS-.5
TS_HLDO_OUT  (via drill 0.51)
  Top 0.508: U7.5 80.64,37.16 79.48,38.33 C39.1 C38.1 81.25,41.63 v81.41,41.79 | TS_HLDO.1 83.29,59.39 v83.29,57.81
  Route15 0.508: v81.41,41.79 81.92,42.3 81.92,56.43 v83.29,57.81
TS_INP
  Top 0.254: 81.5,45.7 R52.1
  Top 0.406: U7.6 79.38,36.93 77.34,38.97 77.34,41.64 C43.1 79.62,45.47 R55.2 | R55.2 78.49,47.05 TS_INP.1 | R55.2 81.5,45.7
TS_ISO_DIAG  (via drill 0.35)
  Top 0.254: U7.14 83.19,24.73 v83.06,24.61 | v81.53,5.06 TS_ISO_DIAG.1
  Route2 0.254: v81.53,5.06 81.53,23.08 v83.06,24.61
VC
  Top 0.254: U6.13 49.52,51.38 48.35,52.55 R40.2

### Text on the board
tPlace: +24V | +5V | SHDN | PRECHARGE_OK | DCDC_ENABLE | Tractive System Board rev8 / Designed by Ethan Su & Liwei Sun